# EasyEDA Pro project ProPrj_2025f4拓展板025-07-20.epro

# Schematic Schematic1
Board Name: Board1; Create Date: 2025-07-18; Page Name: P1; Project Name: 2025电赛拓展板7月; Schematic Name: Schematic1; Update Date: 2025-07-18; Company: 嘉立创EDA; Page Size: A4; Version: V1.0
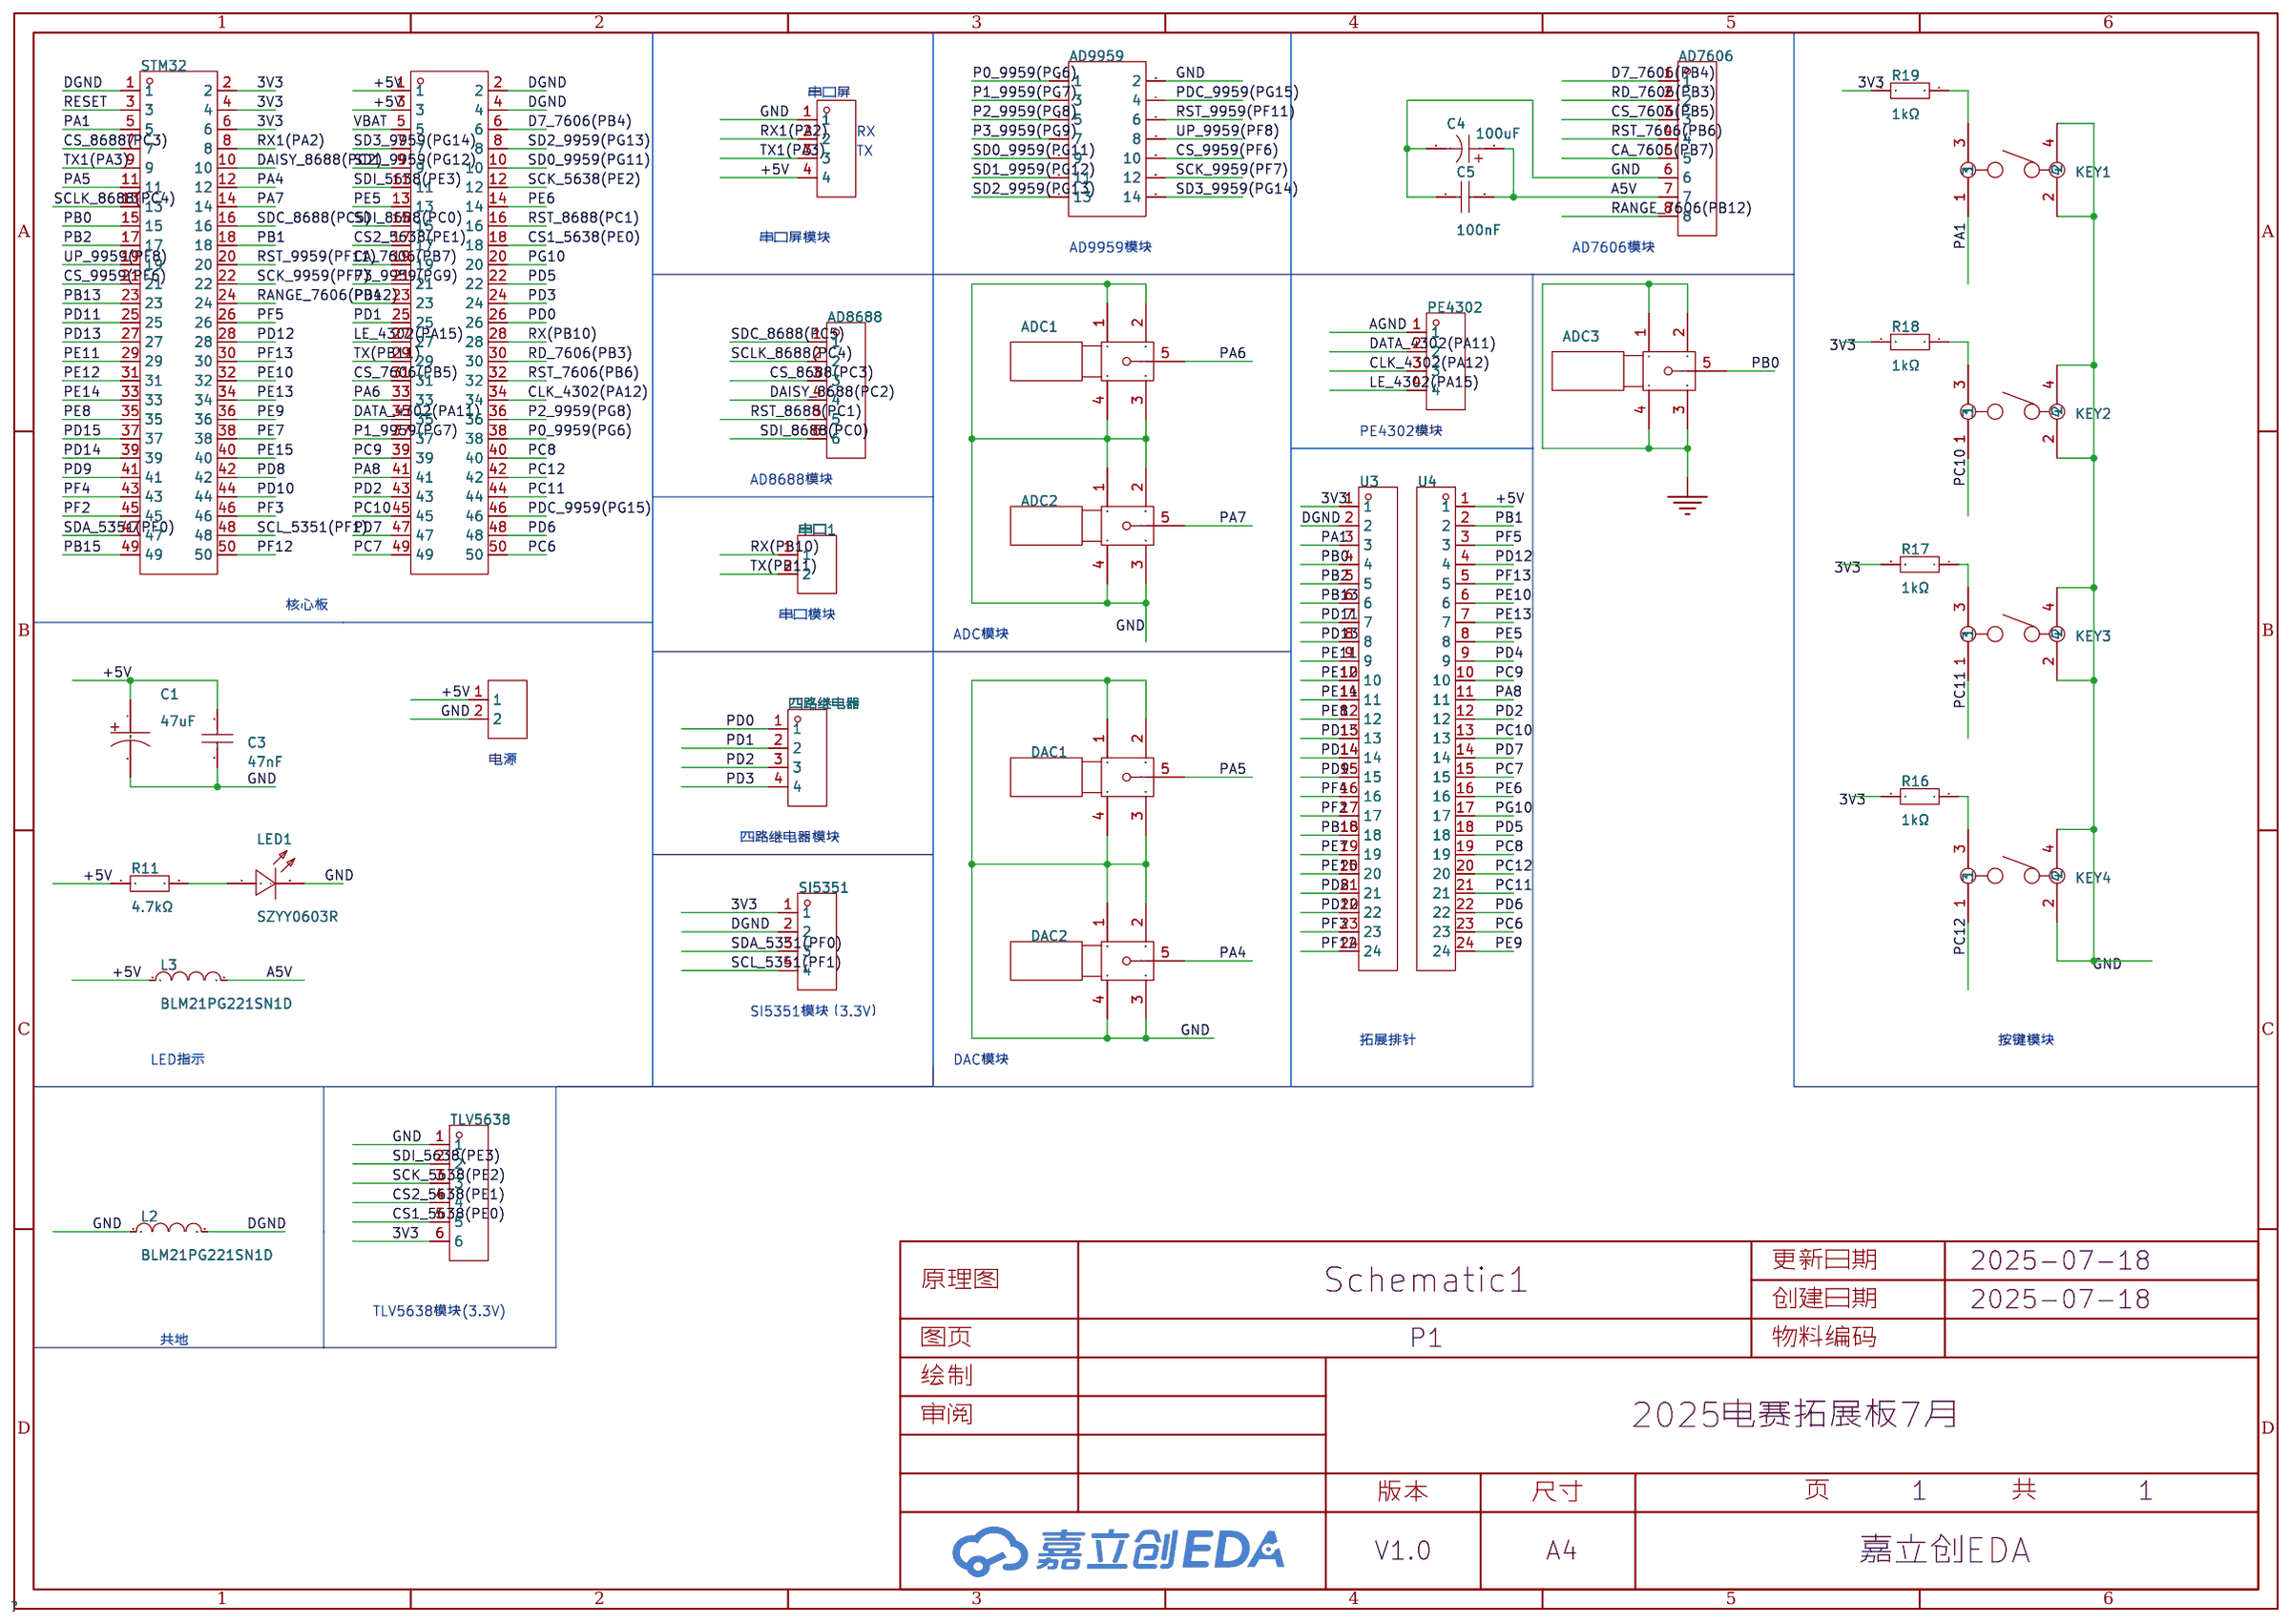
[diagram p0: schematic sheet]

## Parts
AD7606  ZX-XH2.54-8PZZ  [CONN-TH_8P-P2.50-XH2.54-8P]
AD8688  ZX-XH2.54-6PZZ  [CONN-TH_6P-P2.50_ZX-XH2.54-6PZZ]
AD9959  2.54-2*7P简牛  [IDC-TH_14P-P2.54-V-R2-C7-S2.54]
ADC1  BWSMA-KE-P001  [SMA-SMD_BWSMA-KE-P001]
ADC2  BWSMA-KE-P001  [SMA-SMD_BWSMA-KE-P001]
ADC3  BWSMA-KE-P001  [SMA-SMD_BWSMA-KE-P001]
C1  47uF  [CAP-TH_BD5.0-P2.00-D0.8-FD]
C3  47nF  [C0805]
C4  100uF  [CAP-TH_BD8.0-P3.50-D0.5-FD]
C5  100nF  [C0805]
DAC1  BWSMA-KE-P001  [SMA-SMD_BWSMA-KE-P001]
DAC2  BWSMA-KE-P001  [SMA-SMD_BWSMA-KE-P001]
KEY1  -  [4角直插式开关]
KEY2  -  [4角直插式开关]
KEY3  -  [4角直插式开关]
KEY4  -  [4角直插式开关]
L2  BLM21PG221SN1D  [L0805]
L3  BLM21PG221SN1D  [L0805]
LED1  SZYY0603R  [LED0603-R-RD]
OLED显示屏模块2  ZX-XH2.54-4PZZ  [CONN-TH_4P-P2.50_4PIN]
PE4302  ZX-XH2.54-4PZZ  [CONN-TH_4P-P2.50_4PIN]
R11  4.7kΩ  [R0805]
R16  1kΩ  [R0805]
R17  1kΩ  [R0805]
R18  1kΩ  [R0805]
R19  1kΩ  [R0805]
SI5351  ZX-XH2.54-4PZZ  [CONN-TH_4P-P2.50_4PIN]
STM32  ZX-PM2.54-2-25PY  [HDR-TH_50P-P2.54-V-F-R2-C25-S2.54-1]
TLV5638  ZX-XH2.54-6PZZ  [CONN-TH_6P-P2.50_ZX-XH2.54-6PZZ]
U2  ZX-PM2.54-2-25PY  [HDR-TH_50P-P2.54-V-F-R2-C25-S2.54-1]
U3  HC-PM254-8.5H-1x24PZ  [HDR-TH_24P-P2.54-V-F]
U4  HC-PM254-8.5H-1x24PZ  [HDR-TH_24P-P2.54-V-F]
串口  ZX-XH2.54-2PZZ  [CONN-TH_2P-P2.50_HX25003-2A]
串口1  ZX-XH2.54-2PZZ  [CONN-TH_2P-P2.50_HX25003-2A]
四路继电器  ZX-XH2.54-4PZZ  [CONN-TH_4P-P2.50_4PIN]

## Library data of the parts
AD7606 = ZX-XH2.54-8PZZ: 插针结构:1x8P;间距:2.5mm;安装方式:直插;参考系列:XH;总PIN数:8P;排数:1;每排PIN数:8;行距:-;额定电流:3A;触头材质:黄铜;触头镀层:锡;工作温度:-25℃~+85℃;; LCSC Part Name: 1x8P 间距:2.5mm 直插 系列:XH; Supplier Part: C7429638; Manufacturer: Megastar(兆星); Supplier Footprint: 插件,P=2.5mm; JLCPCB Part Class: 扩展库; Datasheet: https://atta.szlcsc.com/upload/public/pdf/source/20230619/688603DEA58996C00B1F33C46797D2C3.pdf; Supplier: LCSC; Pins Structure: 1x8P; Pitch: 2.5mm; Mounting Type: 直插; Reference Series: XH; Number of Pins: 8P; Number of Rows: 1; Number of PINs Per Row: 8; Current Rating: 3A; Contact Material: 黄铜; Contact Plating: 锡; Operating Temperature: -25℃~+85℃; Voltage Rating: 250V; Plastic Material: PA66; Flame Retardant Rating: UL94V-0; Color: 白色; Z-Height of the Board: 7mm; X-Length of Bottom Edge on Board (Spacing Line): 22.5mm; Y-Width of Bottom Edge on Board: 5.9mm
AD8688 TLV5638 = ZX-XH2.54-6PZZ: 插针结构:1x6P;间距:2.5mm;安装方式:直插;参考系列:XH;总PIN数:6P;排数:1;每排PIN数:6;行距:-;额定电流:3A;触头材质:黄铜;触头镀层:锡;工作温度:-25℃~+85℃;; LCSC Part Name: 1x6P 间距:2.5mm 直插 系列:XH; Supplier Part: C7429636; Manufacturer: Megastar(兆星); Supplier Footprint: 插件,P=2.5mm; JLCPCB Part Class: 扩展库; Datasheet: https://atta.szlcsc.com/upload/public/pdf/source/20230619/1243AD0A516E39CD3D274D8985780568.pdf; Supplier: LCSC; Pins Structure: 1x6P; Pitch: 2.5mm; Mounting Type: 直插; Reference Series: XH; Number of Pins: 6P; Number of Rows: 1; Number of PINs Per Row: 6; Current Rating: 3A; Contact Material: 黄铜; Contact Plating: 锡; Operating Temperature: -25℃~+85℃; Voltage Rating: 250V; Plastic Material: PA66; Flame Retardant Rating: UL94V-0; Color: 白色; Z-Height of the Board: 7mm; X-Length of Bottom Edge on Board (Spacing Line): 17.5mm; Y-Width of Bottom Edge on Board: 5.9mm
AD9959 = 2.54-2*7P简牛: 连接器类型:简牛座;间距:2.54mm;结构:2x7P;封装形式:直插;行距:2.54mm;排数:2;每排PIN数:7;触头材质:黄铜;触头镀层:金;; LCSC Part Name: 2.54mm 2x7P 排数:2 每排P数:7; Supplier Part: C11215; Manufacturer: BOOMELE(博穆精密); Supplier Footprint: 插件,P=2.54mm; Datasheet: https://atta.szlcsc.com/upload/public/pdf/source/20131122/1457706661483.pdf; Supplier: LCSC; Connector Type: 简牛座; Pitch: 2.54mm; Structure: 2x7P; Holder Type: 直插; Row Spacing: 2.54mm; Number of Rows: 2; Pin Number in each Row: 7; Contact Material: 黄铜; Contact Plating: 金
ADC1-ADC3 DAC1 DAC2 = BWSMA-KE-P001: 连接器类型:板端;接口类型:内孔;端口数量:1;接口直径:5.2mm;接口长度/高度:-;频率-最大值:-;射频系列:SMA;阻抗:50Ω;样式:偏脚;工作温度范围:-;; LCSC Part Name: 内孔 SMA 偏脚; Supplier Part: C496550; Manufacturer: BAT WIRELESS(蝙蝠无线); Supplier Footprint: SMD; Datasheet: https://atta.szlcsc.com/upload/public/pdf/source/20240320/28FD502871C976DFF213ABFCF2A0ED51.pdf; Supplier: LCSC; Connector Type: 板端; Interface Type: 内孔; Number of Ports: 1; Interface Diameter: 5.2mm; RF Series: SMA; Impedance: 50Ω; Style: 偏脚
C1 = NXB25V47M5*11 2.5TP: 容值:47uF;精度:±20%;额定电压:25V;纹波电流:250mA@100kHz;等效串联电阻(ESR):300mΩ@100kHz;; LCSC Part Name: 47uF ±20% 25V; Supplier Part: C371230; Manufacturer: SAMYOUNG(韩国三莹); Supplier Footprint: 插件,D5xL11mm; JLCPCB Part Class: 扩展库; Datasheet: https://atta.szlcsc.com/upload/public/pdf/source/20190227/C371244_FA85FFEFC2961227CF12E3CCE8C34A7D.pdf; Supplier: LCSC; Tolerance: ±20%; Voltage Rating: 25V; Ripple Current: 250mA@100kHz; Equivalent Series Resistance(ESR): 300mΩ@100kHz; Pin Spacing: 2mm; Diameter: 5mm; Height - Seated (Max): 11mm; Lifetime: 2000hrs@105℃; Operating Temperature: -40℃~+105℃
C3 = CL21B473KBCNNNC: 容值:47nF;精度:±10%;额定电压:50V;材质(温度系数):X7R;; LCSC Part Name: 47nF ±10% 50V; Supplier Part: C53134; Manufacturer: SAMSUNG(三星); Supplier Footprint: 0805; JLCPCB Part Class: 基础库; Datasheet: https://atta.szlcsc.com/upload/public/pdf/source/20160218/1457707763339.pdf; Supplier: LCSC; Tolerance: ±10%; Voltage Rated: 50V; Temperature Coefficient: X7R
C4 = ERG50V100M8X12: 容值:100uF;精度:±20%;额定电压:50V;纹波电流:680mA@120Hz;等效串联电阻(ESR):120mΩ;; LCSC Part Name: 100uF ±20% 50V; Supplier Part: C47344183; Manufacturer: 捷而瑞; Supplier Footprint: 插件,D8xL12mm; JLCPCB Part Class: 扩展库; Datasheet: https://atta.szlcsc.com/upload/public/pdf/source/20250526/717B4C76834FE5C4A331D19A222D031C.pdf; Supplier: LCSC; Tolerance: ±20%; Voltage Rating: 50V; Ripple Current: 680mA@120Hz; Equivalent Series Resistance(ESR): 120mΩ; Diameter: 8mm; Height - Seated (Max): 12mm; Lifetime: 4000hrs@105℃; Operating Temperature: -40℃~+105℃
C5 = CL21B104KBCNNNC: 容值:100nF;精度:±10%;额定电压:50V;材质(温度系数):X7R;; LCSC Part Name: 100nF ±10% 50V; Supplier Part: C1711; Manufacturer: SAMSUNG(三星); Supplier Footprint: 0805; JLCPCB Part Class: 扩展库; Datasheet: https://atta.szlcsc.com/upload/public/pdf/source/20160218/1457707763339.pdf; Supplier: LCSC; Tolerance: ±10%; Voltage Rated: 50V; Temperature Coefficient: X7R
KEY1-KEY4 = 4角直插式开关: 4.5*4.5*3.8
L2 L3 = BLM21PG221SN1D: 标称阻抗@测试频率:220Ω@100MHz;误差:±25%;直流电阻(RDC):45mΩ;; LCSC Part Name: 单路 0805磁珠 阻抗220Ω@100MHz; Supplier Part: C85840; Manufacturer: muRata(村田); Supplier Footprint: 0805; JLCPCB Part Class: 扩展库; Datasheet: https://atta.szlcsc.com/upload/public/pdf/source/20180326/C118443_3FAC30E9A4F0E6B81275543C61E0685E.pdf; Supplier: LCSC; Impedance @ Frequency: 220Ω@100MHz; Tolerance: ±25%; DC Resistance: 45mΩ; Current Rating: 2A; Circuits: 1
LED1 = SZYY0603R: 发光颜色:红色;功率:40mW;正向电流:20mA;主波长:615nm~630nm;二极管配置:-;透镜颜色:无色透明透镜;色温:-;发光角度:120°;载带方式:-;工作温度:-40℃~+85℃;; LCSC Part Name: 红灯; Supplier Part: C434419; Manufacturer: yongyu(永裕光电); Supplier Footprint: 0603; JLCPCB Part Class: 扩展库; Datasheet: https://atta.szlcsc.com/upload/public/pdf/source/20191204/C434419_0B955C1F73FF88449D9A795B6FF49070.pdf; Supplier: LCSC; Emitted Color: 红色; Power Dissipation: 40mW; Forward Current: 20mA; Dominant Wavelength: 615nm~630nm; Peak Wavelength: 645nm; Lens Color: 无色透明透镜; Viewing Angle: 120°; Operating Temperature: -40℃~+85℃
OLED显示屏模块2 PE4302 SI5351 四路继电器 = ZX-XH2.54-4PZZ: 插针结构:1x4P;间距:2.5mm;安装方式:直插;参考系列:XH;总PIN数:4P;排数:1;每排PIN数:4;行距:-;额定电流:3A;触头材质:黄铜;触头镀层:锡;工作温度:-25℃~+85℃;; LCSC Part Name: 1x4P 间距:2.5mm 直插 系列:XH; Supplier Part: C7429634; Manufacturer: Megastar(兆星); Supplier Footprint: 插件,P=2.5mm; JLCPCB Part Class: 扩展库; Datasheet: https://atta.szlcsc.com/upload/public/pdf/source/20230619/B529A2163E0159A644AB3383D208FB03.pdf; Supplier: LCSC; Pins Structure: 1x4P; Pitch: 2.5mm; Mounting Type: 直插; Reference Series: XH; Number of Pins: 4P; Number of Rows: 1; Number of PINs Per Row: 4; Current Rating: 3A; Contact Material: 黄铜; Contact Plating: 锡; Operating Temperature: -25℃~+85℃; Voltage Rating: 250V; Plastic Material: PA66; Flame Retardant Rating: UL94V-0; Color: 白色; Z-Height of the Board: 7mm; X-Length of Bottom Edge on Board (Spacing Line): 12.5mm; Y-Width of Bottom Edge on Board: 5.9mm
R11 = 0805W8F4701T5E: 电阻类型:厚膜电阻;阻值:4.7kΩ;精度:±1%;功率:125mW;最大工作电压:150V;温度系数:±100ppm/℃;; LCSC Part Name: 4.7kΩ ±1% 125mW 厚膜电阻; Supplier Part: C17673; Manufacturer: UNI-ROYAL(厚声); Supplier Footprint: 0805; JLCPCB Part Class: 基础库; Datasheet: https://atta.szlcsc.com/upload/public/pdf/source/20200306/C422600_1E6D84923E4A46A82E41ADD87F860B5C.pdf; Supplier: LCSC; Type: 厚膜电阻; Tolerance: ±1%; Power(Watts): 125mW; Overload Voltage (Max): 150V; Temperature Coefficient: ±100ppm/℃; Operating Temperature Range: -55℃~+155℃
R16-R19 = 0805W8F1001T5E: 电阻类型:厚膜电阻;阻值:1kΩ;精度:±1%;功率:125mW;温度系数:±100ppm/℃;最大工作电压:150V;工作温度范围:-55℃~+155℃;; LCSC Part Name: 1kΩ ±1% 125mW; Supplier Part: C17513; Manufacturer: UNI-ROYAL(厚声); Supplier Footprint: 0805; JLCPCB Part Class: Basic Part; Datasheet: https://atta.szlcsc.com/upload/public/pdf/source/20200306/C422600_1E6D84923E4A46A82E41ADD87F860B5C.pdf; Supplier: LCSC; Type: 厚膜电阻; Tolerance: ±1%; Power(Watts): 125mW; Temperature Coefficient: ±100ppm/℃; Overload Voltage (Max): 150V; Operating Temperature Range: -55℃~+155℃
STM32 U2 = ZX-PM2.54-2-25PY: 插孔结构:2x25P;间距:2.54mm;行距:2.54mm;圆孔/方孔:方孔;安装类型:直插;排数:双排;总孔位数:50P;额定电流:-;额定电压:1kV;插孔方向:顶部;塑高:8.5mm;触头材质:-;触头镀层:金;工作温度范围:-40℃~+105℃;焊接温度(最大值):260℃@5S;; LCSC Part Name: 2x25P 间距:2.54mm 直插; Supplier Part: C7499355; Manufacturer: Megastar(兆星); Supplier Footprint: 插件,P=2.54mm; JLCPCB Part Class: 扩展库; Datasheet: https://atta.szlcsc.com/upload/public/pdf/source/20231122/49E5BFC403566950E1C41AC60FCE7E93.pdf; Supplier: LCSC; Holes Structure: 2x25P; Pitch: 2.54mm; Row Spacing: 2.54mm; Circular Hole / Square Hole: 方孔; Mounting Type: 直插; Number of Rows: 双排; Number of Holes: 50P; Voltage Rating (Max): 1kV; Holes Direction: 顶部; Insulation Height: 8.5mm; Contact Plating: 金; Operating Temperature Range: -40℃~+105℃; Soldering Temperature(Max): 260℃@5S
U3 U4 = HC-PM254-8.5H-1x24PZ: 插孔结构:1x24P;间距:2.54mm;行距:-;圆孔/方孔:方孔;安装方式:直插;排数:单排;总孔位数:24P;额定电流:3A;额定电压:-;插孔方向:顶部;塑高:8.5mm;触头材质:黄铜;触头镀层:金;工作温度:-40℃~+105℃;; LCSC Part Name: 间距2.54mm 1x24Pin 直插 PC3.0 H8.5; Supplier Part: C41376163; Manufacturer: HC(虹成电子); Supplier Footprint: 插件,P=2.54mm; JLCPCB Part Class: 扩展库; Datasheet: https://atta.szlcsc.com/upload/public/pdf/source/20250106/3FBD04873CC9DF7EB7D4CB725B508409.pdf; Supplier: LCSC; Holes Structure: 1x24P; Pitch: 2.54mm; Circular Hole / Square Hole: 方孔; Mounting Type: 直插; Number of Rows: 单排; Number of Positions: 24P; Current Rating: 3A; Holes Direction: 顶部; Insulation Height: 8.5mm; Contact Material: 黄铜; Contact Plating: 金; Operating Temperature: -40℃~+105℃; PIN Length: 3mm
串口 串口1 = ZX-XH2.54-2PZZ: 插针结构:1x2P;间距:2.5mm;安装方式:直插;参考系列:XH;总PIN数:2P;排数:1;每排PIN数:2;行距:-;额定电流:3A;触头材质:黄铜;触头镀层:锡;工作温度:-25℃~+85℃;; LCSC Part Name: 1x2P 间距:2.5mm 直插 系列:XH; Supplier Part: C7429632; Manufacturer: Megastar(兆星); Supplier Footprint: 插件,P=2.5mm; JLCPCB Part Class: 扩展库; Datasheet: https://atta.szlcsc.com/upload/public/pdf/source/20230619/19BA6947230AA44A04D3EDD65E618FD0.pdf; Supplier: LCSC; Pins Structure: 1x2P; Pitch: 2.5mm; Mounting Type: 直插; Reference Series: XH; Number of Pins: 2P; Number of Rows: 1; Number of PINs Per Row: 2; Current Rating: 3A; Contact Material: 黄铜; Contact Plating: 锡; Operating Temperature: -25℃~+85℃; Voltage Rating: 250V; Plastic Material: PA66; Flame Retardant Rating: UL94V-0; Color: 白色; Z-Height of the Board: 7mm; X-Length of Bottom Edge on Board (Spacing Line): 7.5mm; Y-Width of Bottom Edge on Board: 5.9mm

## Nets
3V3: R16.2 R17.2 R18.2 R19.2 SI5351.1 STM32.2 STM32.4 STM32.6 TLV5638.6 U3.1
+5V: C1.1 C3.2 L3.1 OLED显示屏模块2.4 R11.1 U2.1 U2.3 U4.1 串口.1
A5V: AD7606.7 C4.1 C5.2 L3.2
AGND: PE4302.1
DGND: L2.2 SI5351.2 STM32.1 U2.2 U2.4 U3.2
GND: AD7606.6 AD9959.2 ADC1.1 ADC1.2 ADC1.3 ADC1.4 ADC2.1 ADC2.2 ADC2.3 ADC2.4 ADC3.1 ADC3.2 ADC3.3 ADC3.4 C1.2 C3.1 C4.2 C5.1 DAC1.1 DAC1.2 DAC1.3 DAC1.4 DAC2.1 DAC2.2 DAC2.3 DAC2.4 KEY1.2 KEY1.4 KEY2.2 KEY2.4 KEY3.2 KEY3.4 KEY4.2 KEY4.4 L2.1 LED1.2(-) OLED显示屏模块2.1 TLV5638.1 串口.2
VBAT: U2.5
CA_7606(PB7): AD7606.5 U2.19
CLK_4302(PA12): PE4302.3 U2.34
CS1_5638(PE0): TLV5638.5 U2.18
CS2_5638(PE1): TLV5638.4 U2.17
CS_7606(PB5): AD7606.3 U2.31
CS_8688(PC3): AD8688.3 STM32.7
CS_9959(PF6): AD9959.10 STM32.21
D7_7606(PB4): AD7606.1 U2.6
DAISY_8688(PC2): AD8688.4 STM32.10
DATA_4302(PA11): PE4302.2 U2.35
LE_4302(PA15): PE4302.4 U2.27
P0_9959(PG6): AD9959.1 U2.38
P1_9959(PG7): AD9959.3 U2.37
P2_9959(PG8): AD9959.5 U2.36
P3_9959(PG9): AD9959.7 U2.21
PA1: KEY1.1 STM32.5 U3.3
PA4: DAC2.5 STM32.12
PA5: DAC1.5 STM32.11
PA6: ADC1.5 U2.33
PA7: ADC2.5 STM32.14
PA8: U2.41 U4.11
PB0: ADC3.5 STM32.15 U3.4
PB1: STM32.18 U4.2
PB2: STM32.17 U3.5
PB13: STM32.23 U3.6
PB15: STM32.49 U3.18
PC6: U2.50 U4.23
PC7: U2.49 U4.15
PC8: U2.40 U4.19
PC9: U2.39 U4.10
PC10: KEY2.1 U2.45 U4.13
PC11: KEY3.1 U2.44 U4.21
PC12: KEY4.1 U2.42 U4.20
PD0: U2.26 四路继电器.1
PD1: U2.25 四路继电器.2
PD2: U2.43 U4.12 四路继电器.3
PD3: U2.24 四路继电器.4
PD4: U2.23 U4.9
PD5: U2.22 U4.18
PD6: U2.48 U4.22
PD7: U2.47 U4.14
PD8: STM32.42 U3.21
PD9: STM32.41 U3.15
PD10: STM32.44 U3.22
PD11: STM32.25 U3.7
PD12: STM32.28 U4.4
PD13: STM32.27 U3.8
PD14: STM32.39 U3.14
PD15: STM32.37 U3.13
PDC_9959(PG15): AD9959.4 U2.46
PE5: U2.13 U4.8
PE6: U2.14 U4.16
PE7: STM32.38 U3.19
PE8: STM32.35 U3.12
PE9: STM32.36 U4.24
PE10: STM32.32 U4.6
PE11: STM32.29 U3.9
PE12: STM32.31 U3.10
PE13: STM32.34 U4.7
PE14: STM32.33 U3.11
PE15: STM32.40 U3.20
PF2: STM32.45 U3.17
PF3: STM32.46 U3.23
PF4: STM32.43 U3.16
PF5: STM32.26 U4.3
PF12: STM32.50 U3.24
PF13: STM32.30 U4.5
PG10: U2.20 U4.17
RANGE_7606(PB12): AD7606.8 STM32.24
RD_7606(PB3): AD7606.2 U2.30
RESET: STM32.3
RST_7606(PB6): AD7606.4 U2.32
RST_8688(PC1): AD8688.5 U2.16
RST_9959(PF11): AD9959.6 STM32.20
RX1(PA2): OLED显示屏模块2.2 STM32.8
RX(PB10): U2.28 串口1.1
SCK_5638(PE2): TLV5638.3 U2.12
SCK_9959(PF7): AD9959.12 STM32.22
SCL_5351(PF1): SI5351.4 STM32.48
SCLK_8688(PC4): AD8688.2 STM32.13
SD0_9959(PG11): AD9959.9 U2.10
SD1_9959(PG12): AD9959.11 U2.9
SD2_9959(PG13): AD9959.13 U2.8
SD3_9959(PG14): AD9959.14 U2.7
SDA_5351(PF0): SI5351.3 STM32.47
SDC_8688(PC5): AD8688.1 STM32.16
SDI_5638(PE3): TLV5638.2 U2.11
SDI_8688(PC0): AD8688.6 U2.15
TX1(PA3): OLED显示屏模块2.3 STM32.9
TX(PB11): U2.29 串口1.2
UP_9959(PF8): AD9959.8 STM32.19
$1N1573: LED1.1(+) R11.2
Net-(KEY1-3): KEY1.3 R19.1
Net-(KEY2-3): KEY2.3 R18.1
Net-(KEY3-3): KEY3.3 R17.1
Net-(KEY4-3): KEY4.3 R16.1

## Notes on the sheet
- 串口屏
- RX
- TX
- 串口屏模块
- AD9959模块
- AD7606模块
- PE4302模块
- AD8688模块
- 核心板
- 串口模块
- ADC模块
- 电源
- 四路继电器模块
- SI5351模块（3.3V）
- 拓展排针
- 按键模块
- LED指示
- DAC模块
- TLV5638模块(3.3V)
- 共地

# Board PCB1
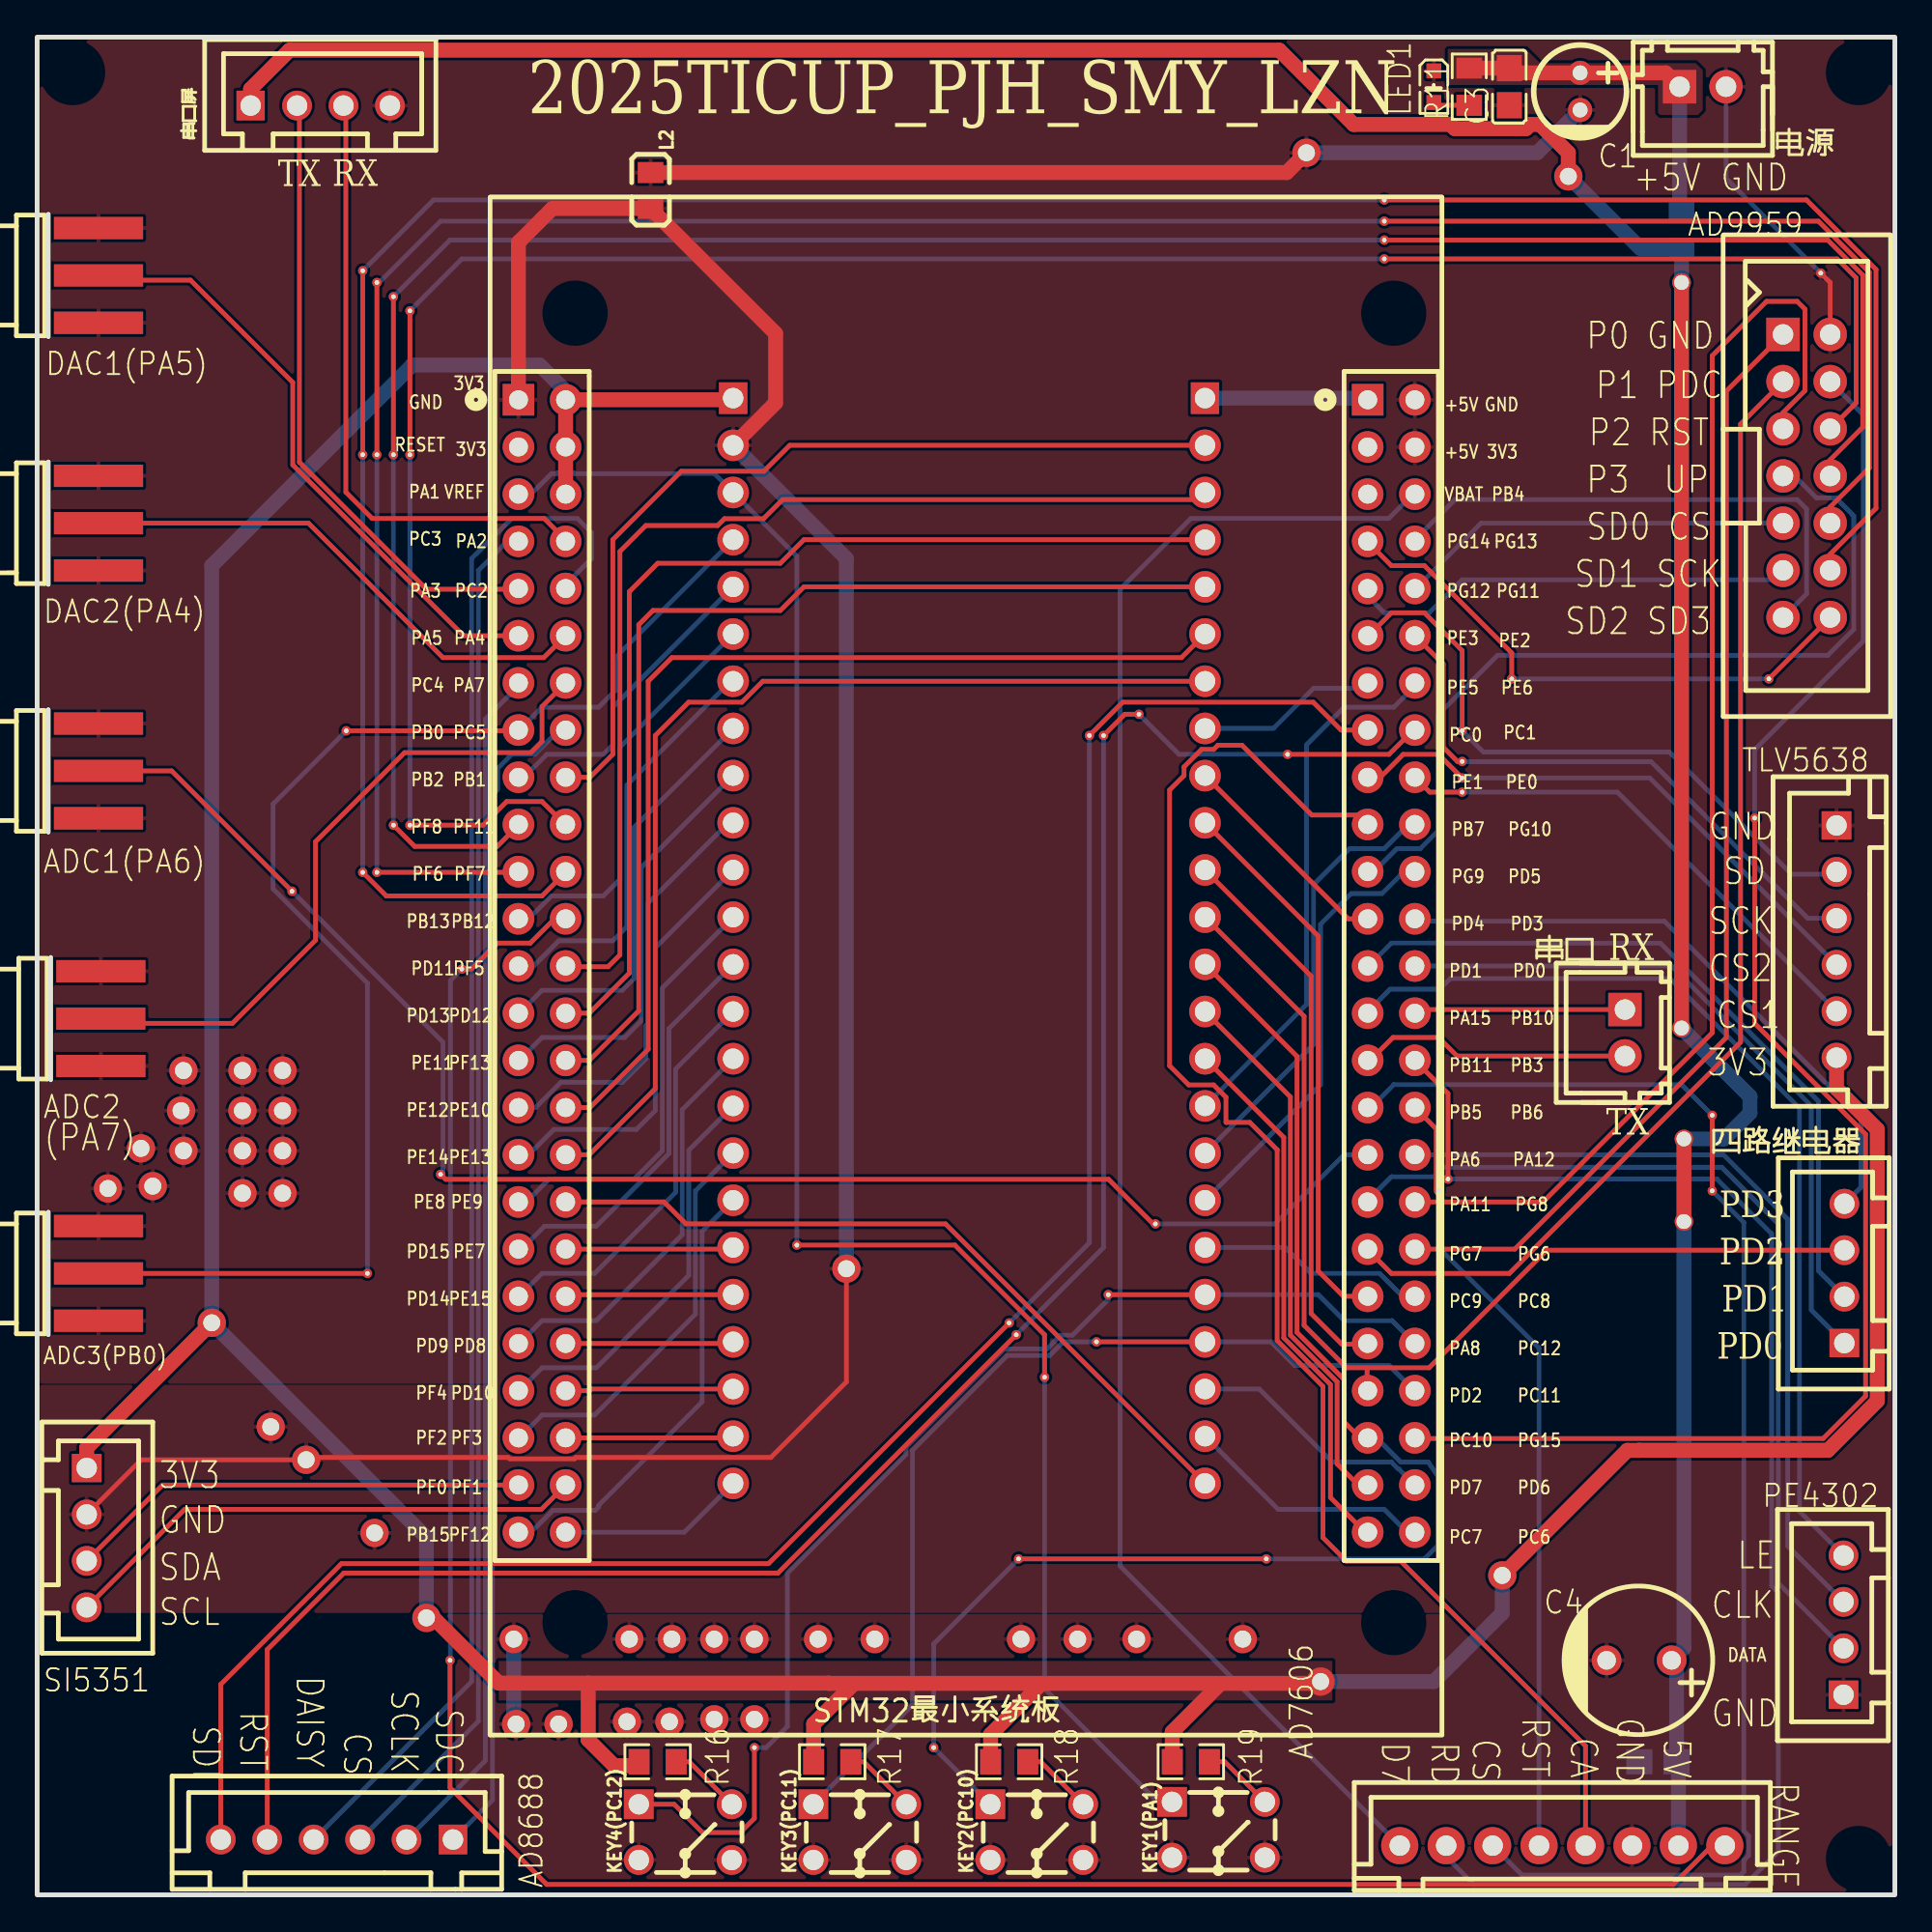
[diagram p1: board, top side]
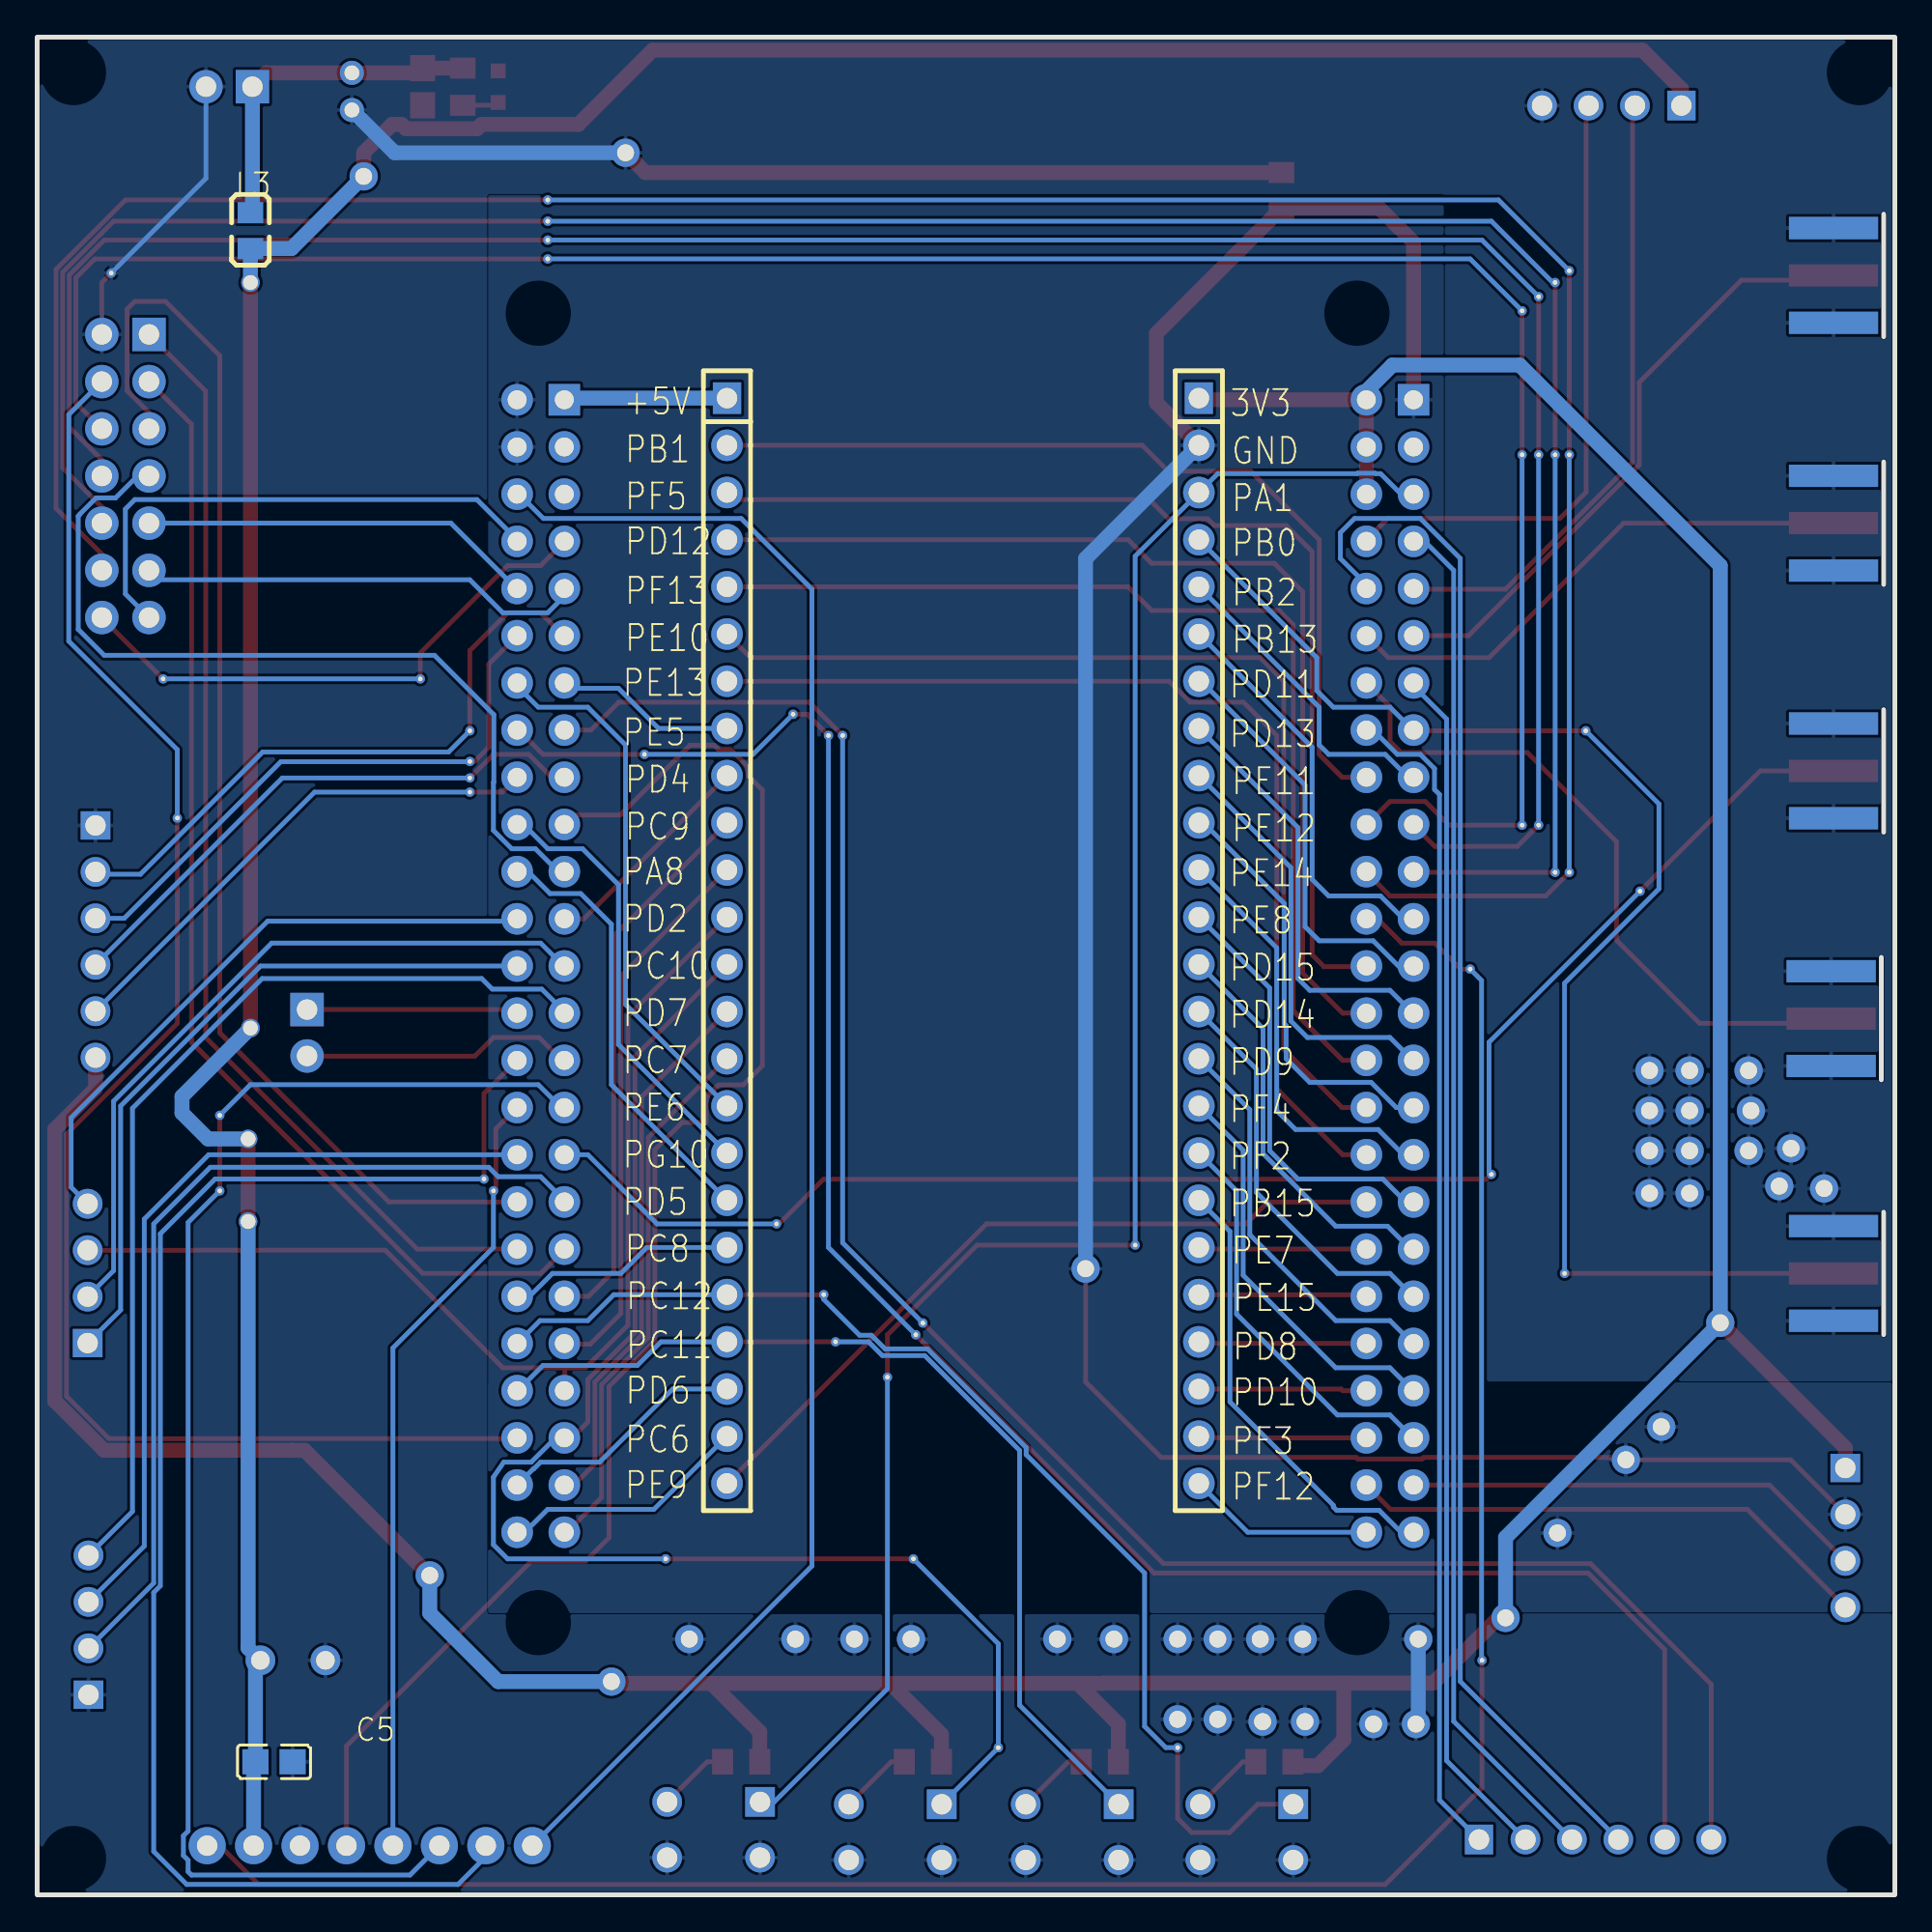
[diagram p2: board, bottom side, seen from below]

Outline 100 x 100 mm; copper layers: Top Layer, Bottom Layer. Coordinates in mm from the lower left corner of the outline.
Outline path: rectangle 0,100 100,0
Stack: Top Layer 0.035mm / Dielectric1 1.51mm FR4 er 4.5 / Bottom Layer 0.035mm

## Design rules (mm)
template: JLCPCB Capability(Two Layers Board)
spacing copperThickness1oz (default): track to track 0.102, other pairs 0.152 to 0.3
spacing copperThickness2oz: track to track 0.203, other pairs 0.152 to 0.3
track width copperThickness1oz (default): min 0.127, default 0.254, max 2.54
track width copperThickness2oz: min 0.203, default 0.254, max 2.54
differential pair differentialPair (default): width min 0.127, default 0.254, max 2.54; gap min 0.152, default 0.152
via viaSize (default): diameter min 0.5, default 0.61, max 10; hole min 0.3, default 0.305, max 6.3

## Placement (name value [footprint] x y rotation side)
AD7606  ZX-XH2.54-8PZZ  [CONN-TH_8P-P2.50-XH2.54-8P]  82.1 2.65 180 top
AD8688  ZX-XH2.54-6PZZ  [CONN-TH_6P-P2.50_ZX-XH2.54-6PZZ]  16.13 2.98 0 top
AD9959  2.54-2*7P简牛  [IDC-TH_14P-P2.54-V-R2-C7-S2.54]  95.25 76.38 270 top
ADC1(PA6)  BWSMA-KE-P001  [SMA-SMD_BWSMA-KE-P001]  3.3 60.5 180 top
ADC2  BWSMA-KE-P001  [SMA-SMD_BWSMA-KE-P001]  3.43 47.17 180 top
ADC3(PB0)  BWSMA-KE-P001  [SMA-SMD_BWSMA-KE-P001]  3.3 33.45 180 top
C1  47uF  [CAP-TH_BD5.0-P2.00-D0.8-FD]  83.06 97.08 270 top
C3  47nF  [C0805]  79.25 97.33 90 top
C4  100uF  [CAP-TH_BD8.0-P3.50-D0.5-FD]  86.23 12.62 180 top
C5  100nF  [C0805]  87.25 7.16 0 bottom
DAC1(PA5)  BWSMA-KE-P001  [SMA-SMD_BWSMA-KE-P001]  3.3 87.17 180 top
DAC2(PA4)  BWSMA-KE-P001  [SMA-SMD_BWSMA-KE-P001]  3.3 73.84 180 top
KEY1(PA1)  -  [4角直插式开关]  61.09 5 0 top
KEY2(PC10)  -  [4角直插式开关]  51.31 4.88 0 top
KEY3(PC11)  -  [4角直插式开关]  41.78 4.88 0 top
KEY4(PC12)  -  [4角直插式开关]  32.38 4.88 0 top
L2  BLM21PG221SN1D  [L0805]  33.02 91.75 270 top
L3  BLM21PG221SN1D  [L0805]  88.52 89.59 270 bottom
LED1  SZYY0603R  [LED0603-R-RD]  75.18 97.33 270 top
NOREF  -  [Pad_e1397]  88.52 86.79 0 top
NOREF#2  -  [Pad_e2048]  13.21 42.22 0 top
NOREF#3  -  [Pad_e2021]  36.45 9.45 0 top
NOREF#4  -  [Pad_e1139]  93.22 65.46 0 top
NOREF#5  -  [Pad_e2028]  52.96 13.77 0 top
NOREF#6  -  [Pad_e2050]  13.21 37.77 0 top
NOREF#7  -  [Pad_e732]  76.71 61.01 0 top
NOREF#8  -  [Pad_e2063]  69.09 11.48 0 top
NOREF#9  -  [Pad_e965]  56.64 62.41 0 top
NOREF#10  -  [Pad_e150]  66.17 18.09 0 top
NOREF#11  -  [Pad_e2019]  34.16 13.77 0 top
NOREF#12  -  [Pad_e902]  90.17 37.9 0 top
NOREF#13  -  [Pad_e3359]  96.01 87.3 0 top
NOREF#14  -  [Pad_e2039]  3.81 38.02 0 top
NOREF#15  -  [Pad_e1266]  19.18 86.03 0 top
NOREF#16  -  [Pad_e983]  59.31 63.55 0 top
NOREF#17  -  [Pad_e1928]  43.56 33.71 0 top
NOREF#18  -  [Pad_e1285]  17.53 55.04 0 top
NOREF#19  -  [Pad_e2114]  16.64 62.66 0 top
NOREF#20  -  [Pad_e2036]  14.48 23.42 0 top
NOREF#21  -  [Pad_e96]  38.61 7.93 0 top
NOREF#22  -  [Pad_e2020]  36.45 13.77 0 top
NOREF#23  -  [Pad_e2040]  5.59 40.18 0 top
NOREF#24  -  [Pad_e148]  52.83 18.09 0 top
NOREF#25  -  [Pad_e2047]  13.21 44.37 0 top
NOREF#26  -  [Pad_e1288]  20.07 57.58 0 top
NOREF#27  -  [Pad_e141]  57.02 29.77 0 top
NOREF#28  -  [Pad_e1860]  28.07 9.19 0 top
NOREF#29  -  [Pad_e2038]  6.22 38.15 0 top
NOREF#30  -  [Pad_e2109]  17.78 33.45 0 top
NOREF#31  -  [Pad_e1407]  88.65 36.25 0 top
NOREF#32  -  [Pad_e1026]  22.22 12.62 0 top
NOREF#33  -  [Pad_e890]  75.95 38.53 0 top
NOREF#34  -  [Pad_e1400]  88.52 46.66 0 top
NOREF#35  -  [Pad_e2022]  38.61 9.45 0 top
NOREF#36  -  [Pad_e2018]  34.04 9.32 0 top
NOREF#37  -  [Pad_e1280]  20.07 77.52 0 top
NOREF#38  -  [Pad_e1287]  19.18 57.58 0 top
NOREF#39  -  [Pad_e725]  76.71 60.12 0 top
NOREF#40  -  [Pad_e2045]  11.05 40.06 0 top
NOREF#41  -  [Pad_e1919]  54.23 27.86 0 top
NOREF#42  -  [Pad_e2025]  42.04 13.77 0 top
NOREF#43  -  [Pad_e1028]  22.86 49.83 0 top
NOREF#44  -  [Pad_e1171]  92.46 57.96 0 top
NOREF#45  -  [Pad_e2023]  38.61 13.77 0 top
NOREF#46  -  [Pad_e728]  76.71 62.66 0 top
NOREF#47  -  [Pad_e2067]  78.87 17.2 0 top
NOREF#48  -  [Pad_e1232]  72.52 90.09 0 top
NOREF#49  -  [Pad_e1141]  79.38 65.46 0 top
NOREF#50  -  [Pad_e1233]  72.52 89.08 0 top
NOREF#51  -  [Pad_e2041]  7.75 42.22 0 top
NOREF#52  -  [Pad_e3627]  9.4 30.79 0 top
NOREF#53  -  [Pad_e2015]  31.75 9.32 0 top
NOREF#54  -  [Pad_e1859]  64.9 13.77 0 top
NOREF#55  -  [Pad_e1355]  75.44 37.9 0 top
NOREF#56  -  [Pad_e1934]  68.33 93.78 0 top
NOREF#57  -  [Pad_e1286]  18.29 55.04 0 top
NOREF#58  -  [Pad_e1234]  72.52 88.06 0 top
NOREF#59  -  [Pad_e1279]  19.18 77.52 0 top
NOREF#60  -  [Pad_e1265]  18.29 86.79 0 top
NOREF#61  -  [Pad_e2016]  25.65 13.77 0 top
NOREF#62  -  [Pad_e2033]  12.57 25.2 0 top
NOREF#63  -  [Pad_e2026]  45.09 13.77 0 top
NOREF#64  -  [Pad_e1345]  13.72 54.03 0 top
NOREF#65  -  [Pad_e960]  52.71 30.15 0 top
NOREF#66  -  [Pad_e1881]  57.66 32.31 0 top
NOREF#67  -  [Pad_e1861]  25.78 9.19 0 top
NOREF#68  -  [Pad_e2042]  7.87 44.37 0 top
NOREF#69  -  [Pad_e1405]  88.65 40.69 0 top
NOREF#70  -  [Pad_e2037]  7.87 40.06 0 top
NOREF#71  -  [Pad_e1277]  17.53 77.52 0 top
NOREF#72  -  [Pad_e2046]  11.05 37.77 0 top
NOREF#73  -  [Pad_e1354]  60.2 36.12 0 top
NOREF#74  -  [Pad_e1940]  40.89 34.98 0 top
NOREF#75  -  [Pad_e1278]  18.29 77.52 0 top
NOREF#76  -  [Pad_e2030]  18.16 19.48 0 top
NOREF#77  -  [Pad_e959]  52.32 30.78 0 top
NOREF#78  -  [Pad_e54]  20.95 14.91 0 top
NOREF#79  -  [Pad_e2029]  56.01 13.77 0 top
NOREF#80  -  [Pad_e1264]  17.53 87.43 0 top
NOREF#81  -  [Pad_e145]  48.26 7.93 0 top
NOREF#82  -  [Pad_e2017]  31.88 13.77 0 top
NOREF#83  -  [Pad_e2094]  82.42 92.51 0 top
NOREF#84  -  [Pad_e2049]  13.21 40.06 0 top
NOREF#85  -  [Pad_e2044]  11.05 42.22 0 top
NOREF#86  -  [Pad_e1267]  20.07 85.27 0 top
NOREF#87  -  [Pad_e727]  76.71 59.36 0 top
NOREF#88  -  [Pad_e904]  90.17 41.96 0 top
NOREF#89  -  [Pad_e1348]  21.72 38.79 0 top
NOREF#90  -  [Pad_e966]  57.4 62.41 0 top
NOREF#91  -  [Pad_e2043]  11.05 44.37 0 top
NOREF#92  -  [Pad_e1858]  59.18 13.77 0 top
NOREF#93  -  [Pad_e988]  67.31 61.39 0 top
NOREF#94  -  [Pad_e1231]  72.52 91.24 0 top
PE4302  ZX-XH2.54-4PZZ  [CONN-TH_4P-P2.50_4PIN]  97.24 14.52 90 top
R11  4.7kΩ  [R0805]  77.09 97.33 270 top
R16  1kΩ  [R0805]  33.4 7.16 180 top
R17  1kΩ  [R0805]  42.8 7.16 180 top
R18  1kΩ  [R0805]  52.32 7.16 180 top
R19  1kΩ  [R0805]  62.1 7.16 180 top
SI5351  ZX-XH2.54-4PZZ  [CONN-TH_4P-P2.50_4PIN]  2.67 19.23 270 top
STM32最小系统板  ZX-PM2.54-2-25PY  [HDR-TH_50P-P2.54-V-F-R2-C25-S2.54-1]  27.18 50 270 top
TLV5638  ZX-XH2.54-6PZZ  [CONN-TH_6P-P2.50_ZX-XH2.54-6PZZ]  96.86 51.32 90 top
U2  ZX-PM2.54-2-25PY  [HDR-TH_50P-P2.54-V-F-R2-C25-S2.54-1]  72.89 50 270 top
U3  HC-PM254-8.5H-1x24PZ  [HDR-TH_24P-P2.54-V-F]  37.47 51.36 270 bottom
U4  HC-PM254-8.5H-1x24PZ  [HDR-TH_24P-P2.54-V-F]  62.87 51.36 270 bottom
串口  ZX-XH2.54-2PZZ  [CONN-TH_2P-P2.50_HX25003-2A]  85.47 46.41 270 top
串口屏  ZX-XH2.54-4PZZ  [CONN-TH_4P-P2.50_4PIN]  15.24 96.32 0 top
四路继电器  ZX-XH2.54-4PZZ  [CONN-TH_4P-P2.50_4PIN]  97.28 33.45 90 top
电源  ZX-XH2.54-2PZZ  [CONN-TH_2P-P2.50_HX25003-2A]  89.66 97.33 0 top

## Footprints (pads in the part's own frame, mm; a bottom-side part is the same pattern mirrored in y, then rotated)
4角直插式开关
  rect 1.6x1.6 hole 1.1: 1(0,0)
  round 1.6 hole 1.1: 2(5,0) 3(0,-3) 4(5,-3)
C0805
  rect 1.41x1.35 smd: 1(-1,0) 2(1,0)
CAP-TH_BD5.0-P2.00-D0.8-FD
  round 1.3 hole 0.8: 1(-1,0) 2(1,0)
CAP-TH_BD8.0-P3.50-D0.5-FD
  round 1.6 hole 1: 1(-1.75,0) 2(1.75,0)
CONN-TH_2P-P2.50_HX25003-2A
  rect 1.8x1.8 hole 1.1: 1(-1.25,0)
  round 1.8 hole 1.1: 2(1.25,0)
CONN-TH_4P-P2.50_4PIN
  rect 1.524x1.6 hole 1.1: 1(-3.75,0)
  round 1.6 hole 1.1: 2(-1.25,0) 3(1.25,0) 4(3.75,0)
CONN-TH_6P-P2.50_ZX-XH2.54-6PZZ
  rect 1.524x1.6 hole 1.1: 1(6.25,0)
  round 1.6 hole 1.1: 2(3.75,0) 3(1.25,0) 4(-1.25,0) 5(-3.75,0) 6(-6.25,0)
CONN-TH_8P-P2.50-XH2.54-8P
  round 2 hole 1.1: 1(8.75,0) 2(6.25,0) 3(3.75,0) 4(1.25,0) 5(-1.25,0) 6(-3.75,0) 7(-6.25,0) 8(-8.75,0)
HDR-TH_24P-P2.54-V-F
  rect 1.7x1.524 hole 1.1: 1(-29.21,0)
  round 1.7 hole 1.1: 2(-26.67,0) 3(-24.13,0) 4(-21.59,0) 5(-19.05,0) 6(-16.51,0) 7(-13.97,0) 8(-11.43,0) 9(-8.89,0) 10(-6.35,0) 11(-3.81,0) 12(-1.27,0) 13(1.27,0) 14(3.81,0) 15(6.35,0) 16(8.89,0) 17(11.43,0) 18(13.97,0) 19(16.51,0) 20(19.05,0) 21(21.59,0) 22(24.13,0) 23(26.67,0) 24(29.21,0)
HDR-TH_50P-P2.54-V-F-R2-C25-S2.54-1
  rect 1.7x1.7 hole 1.02: 1(-30.48,-1.27)
  round 1.7 hole 1.02: 2(-30.48,1.27) 3(-27.94,-1.27) 4(-27.94,1.27) 5(-25.4,-1.27) 6(-25.4,1.27) 7(-22.86,-1.27) 8(-22.86,1.27) 9(-20.32,-1.27) 10(-20.32,1.27) 11(-17.78,-1.27) 12(-17.78,1.27) 13(-15.24,-1.27) 14(-15.24,1.27) 15(-12.7,-1.27) 16(-12.7,1.27) 17(-10.16,-1.27) 18(-10.16,1.27) 19(-7.62,-1.27) 20(-7.62,1.27) 21(-5.08,-1.27) 22(-5.08,1.27) 23(-2.54,-1.27) 24(-2.54,1.27) 25(0,-1.27) 26(0,1.27) 27(2.54,-1.27) 28(2.54,1.27) 29(5.08,-1.27) 30(5.08,1.27) 31(7.62,-1.27) 32(7.62,1.27) 33(10.16,-1.27) 34(10.16,1.27) 35(12.7,-1.27) 36(12.7,1.27) 37(15.24,-1.27) 38(15.24,1.27) 39(17.78,-1.27) 40(17.78,1.27) 41(20.32,-1.27) 42(20.32,1.27) 43(22.86,-1.27) 44(22.86,1.27) 45(25.4,-1.27) 46(25.4,1.27) 47(27.94,-1.27) 48(27.94,1.27) 49(30.48,-1.27) 50(30.48,1.27)
IDC-TH_14P-P2.54-V-R2-C7-S2.54
  rect 1.8x1.8 hole 1.1: 1(-7.62,-1.27)
  round 1.8 hole 1.1: 2(-7.62,1.27) 3(-5.08,-1.27) 4(-5.08,1.27) 5(-2.54,-1.27) 6(-2.54,1.27) 7(0,-1.27) 8(0,1.27) 9(2.54,-1.27) 10(2.54,1.27) 11(5.08,-1.27) 12(5.08,1.27) 13(7.62,-1.27) 14(7.62,1.27)
L0805
  rect 1.133x1.377 smd: 1(-0.966,0) 2(0.966,0)
LED0603-R-RD
  rect 0.8x0.8 smd: 1(0.851,0) 2(-0.851,0)
Pad_e54
  round 1.524 hole 0.914: 1(0,0)
Pad_e96
  round 0.5 hole 0.25: 1(0,0)
Pad_e141
  round 0.5 hole 0.25: 1(0,0)
Pad_e145
  round 0.5 hole 0.25: 1(0,0)
Pad_e148
  round 0.5 hole 0.25: 1(0,0)
Pad_e150
  round 0.5 hole 0.25: 1(0,0)
Pad_e725
  round 0.5 hole 0.25: 1(0,0)
Pad_e727
  round 0.5 hole 0.25: 1(0,0)
Pad_e728
  round 0.5 hole 0.25: 1(0,0)
Pad_e732
  round 0.5 hole 0.25: 1(0,0)
Pad_e890
  round 0.5 hole 0.25: 1(0,0)
Pad_e902
  round 0.5 hole 0.25: 1(0,0)
Pad_e904
  round 0.5 hole 0.25: 1(0,0)
Pad_e959
  round 0.5 hole 0.25: 1(0,0)
Pad_e960
  round 0.5 hole 0.25: 1(0,0)
Pad_e965
  round 0.5 hole 0.25: 1(0,0)
Pad_e966
  round 0.5 hole 0.25: 1(0,0)
Pad_e983
  round 0.5 hole 0.25: 1(0,0)
Pad_e988
  round 0.5 hole 0.25: 1(0,0)
Pad_e1026
  round 0.5 hole 0.25: 1(0,0)
Pad_e1028
  round 0.5 hole 0.25: 1(0,0)
Pad_e1139
  round 0.5 hole 0.25: 1(0,0)
Pad_e1141
  round 0.5 hole 0.25: 1(0,0)
Pad_e1171
  round 0.5 hole 0.25: 1(0,0)
Pad_e1231
  round 0.5 hole 0.25: 1(0,0)
Pad_e1232
  round 0.5 hole 0.25: 1(0,0)
Pad_e1233
  round 0.5 hole 0.25: 1(0,0)
Pad_e1234
  round 0.5 hole 0.25: 1(0,0)
Pad_e1264
  round 0.5 hole 0.25: 1(0,0)
Pad_e1265
  round 0.5 hole 0.25: 1(0,0)
Pad_e1266
  round 0.5 hole 0.25: 1(0,0)
Pad_e1267
  round 0.5 hole 0.25: 1(0,0)
Pad_e1277
  round 0.5 hole 0.25: 1(0,0)
Pad_e1278
  round 0.5 hole 0.25: 1(0,0)
Pad_e1279
  round 0.5 hole 0.25: 1(0,0)
Pad_e1280
  round 0.5 hole 0.25: 1(0,0)
Pad_e1285
  round 0.5 hole 0.25: 1(0,0)
Pad_e1286
  round 0.5 hole 0.25: 1(0,0)
Pad_e1287
  round 0.5 hole 0.25: 1(0,0)
Pad_e1288
  round 0.5 hole 0.25: 1(0,0)
Pad_e1345
  round 0.5 hole 0.25: 1(0,0)
Pad_e1348
  round 0.5 hole 0.25: 1(0,0)
Pad_e1354
  round 0.5 hole 0.25: 1(0,0)
Pad_e1355
  round 0.5 hole 0.25: 1(0,0)
Pad_e1397
  round 1 hole 0.8: 1(0,0)
Pad_e1400
  round 1 hole 0.8: 1(0,0)
Pad_e1405
  round 1 hole 0.8: 1(0,0)
Pad_e1407
  round 1 hole 0.8: 1(0,0)
Pad_e1858
  round 1.524 hole 0.914: 1(0,0)
Pad_e1859
  round 1.524 hole 0.914: 1(0,0)
Pad_e1860
  round 1.524 hole 0.914: 1(0,0)
Pad_e1861
  round 1.524 hole 0.914: 1(0,0)
Pad_e1881
  round 0.5 hole 0.25: 1(0,0)
Pad_e1919
  round 0.5 hole 0.25: 1(0,0)
Pad_e1928
  round 1.524 hole 0.914: 1(0,0)
Pad_e1934
  round 1.524 hole 0.914: 1(0,0)
Pad_e1940
  round 0.5 hole 0.25: 1(0,0)
Pad_e2015
  round 1.524 hole 0.914: 1(0,0)
Pad_e2016
  round 1.524 hole 0.914: 1(0,0)
Pad_e2017
  round 1.524 hole 0.914: 1(0,0)
Pad_e2018
  round 1.524 hole 0.914: 1(0,0)
Pad_e2019
  round 1.524 hole 0.914: 1(0,0)
Pad_e2020
  round 1.524 hole 0.914: 1(0,0)
Pad_e2021
  round 1.524 hole 0.914: 1(0,0)
Pad_e2022
  round 1.524 hole 0.914: 1(0,0)
Pad_e2023
  round 1.524 hole 0.914: 1(0,0)
Pad_e2025
  round 1.524 hole 0.914: 1(0,0)
Pad_e2026
  round 1.524 hole 0.914: 1(0,0)
Pad_e2028
  round 1.524 hole 0.914: 1(0,0)
Pad_e2029
  round 1.524 hole 0.914: 1(0,0)
Pad_e2030
  round 1.524 hole 0.914: 1(0,0)
Pad_e2033
  round 1.524 hole 0.914: 1(0,0)
Pad_e2036
  round 1.524 hole 0.914: 1(0,0)
Pad_e2037
  round 1.524 hole 0.914: 1(0,0)
Pad_e2038
  round 1.524 hole 0.914: 1(0,0)
Pad_e2039
  round 1.524 hole 0.914: 1(0,0)
Pad_e2040
  round 1.524 hole 0.914: 1(0,0)
Pad_e2041
  round 1.524 hole 0.914: 1(0,0)
Pad_e2042
  round 1.524 hole 0.914: 1(0,0)
Pad_e2043
  round 1.524 hole 0.914: 1(0,0)
Pad_e2044
  round 1.524 hole 0.914: 1(0,0)
Pad_e2045
  round 1.524 hole 0.914: 1(0,0)
Pad_e2046
  round 1.524 hole 0.914: 1(0,0)
Pad_e2047
  round 1.524 hole 0.914: 1(0,0)
Pad_e2048
  round 1.524 hole 0.914: 1(0,0)
Pad_e2049
  round 1.524 hole 0.914: 1(0,0)
Pad_e2050
  round 1.524 hole 0.914: 1(0,0)
Pad_e2063
  round 1.524 hole 0.914: 1(0,0)
Pad_e2067
  round 1.524 hole 0.914: 1(0,0)
Pad_e2094
  round 1.524 hole 0.914: 1(0,0)
Pad_e2109
  round 0.5 hole 0.25: 1(0,0)
Pad_e2114
  round 0.5 hole 0.25: 1(0,0)
Pad_e3359
  round 0.5 hole 0.25: 1(0,0)
Pad_e3627
  round 1.524 hole 0.914: 1(0,0)
R0805
  rect 1.133x1.377 smd: 1(-1,0) 2(1,0)
SMA-SMD_BWSMA-KE-P001
  rect 4.8x1.2 smd: 1(0,-2.55) 2(0,2.55) 5(0,0)
  rect 4.8x1.2 smd far side: 3(0,2.55) 4(0,-2.55)

## Nets
3V3: NOREF#8.1 NOREF#47.1 NOREF#52.1 NOREF#78.1 R16.2 R17.2 R18.2 R19.2 SI5351.1 STM32最小系统板.2 STM32最小系统板.4 STM32最小系统板.6 TLV5638.6 U3.1
5V: U2.1 U2.3 U4.1
+5V: C1.1 C3.2 L3.1 R11.1 电源.1
A5V: AD7606.7 C4.1 C5.2 L3.2 NOREF.1 NOREF#31.1 NOREF#34.1 NOREF#69.1 NOREF#83.1 串口屏.1
DGND: L2.2 NOREF#17.1 NOREF#20.1 NOREF#62.1 NOREF#76.1 SI5351.2 STM32最小系统板.1 U2.2 U2.4 U3.2
GND: AD7606.6 AD9959.2 ADC1(PA6).1 ADC1(PA6).2 ADC1(PA6).3 ADC1(PA6).4 ADC2.1 ADC2.2 ADC2.3 ADC2.4 ADC3(PB0).1 ADC3(PB0).2 ADC3(PB0).3 ADC3(PB0).4 C1.2 C3.1 C4.2 C5.1 DAC1(PA5).1 DAC1(PA5).2 DAC1(PA5).3 DAC1(PA5).4 DAC2(PA4).1 DAC2(PA4).2 DAC2(PA4).3 DAC2(PA4).4 KEY1(PA1).3 KEY1(PA1).4 KEY2(PC10).3 KEY2(PC10).4 KEY3(PC11).3 KEY3(PC11).4 KEY4(PC12).3 KEY4(PC12).4 L2.1 LED1.2 NOREF#2.1 NOREF#3.1 NOREF#5.1 NOREF#6.1 NOREF#11.1 NOREF#13.1 NOREF#14.1 NOREF#22.1 NOREF#23.1 NOREF#25.1 NOREF#28.1 NOREF#29.1 NOREF#35.1 NOREF#36.1 NOREF#40.1 NOREF#42.1 NOREF#45.1 NOREF#51.1 NOREF#53.1 NOREF#54.1 NOREF#56.1 NOREF#61.1 NOREF#63.1 NOREF#67.1 NOREF#68.1 NOREF#70.1 NOREF#72.1 NOREF#79.1 NOREF#82.1 NOREF#84.1 NOREF#85.1 NOREF#91.1 NOREF#92.1 PE4302.1 TLV5638.1 串口屏.4 电源.2
VBAT: U2.5
CA_7606(PB7): AD7606.5 U2.19
CLK_4302(PA12): PE4302.3 U2.34
CS1_5638(PE0): NOREF#87.1 TLV5638.5 U2.18
CS2_5638(PE1): NOREF#39.1 TLV5638.4 U2.17
CS_7606(PB5): AD7606.3 NOREF#12.1 NOREF#88.1 U2.31
CS_8688(PC3): AD8688.3 STM32最小系统板.7
CS_9959(PF6): AD9959.10 NOREF#48.1 NOREF#57.1 NOREF#60.1 NOREF#75.1 STM32最小系统板.21
D7_7606(PB4): AD7606.1 U2.6
DAISY_8688(PC2): AD8688.4 STM32最小系统板.10
DATA_4302(PA11): PE4302.2 U2.35
LE_4302(PA15): PE4302.4 U2.27
P0_9959(PG6): AD9959.1 U2.38
P1_9959(PG7): AD9959.3 U2.37
P2_9959(PG8): AD9959.5 U2.36
P3_9959(PG9): AD9959.7 U2.21
PA1: KEY1(PA1).1 NOREF#41.1 NOREF#74.1 STM32最小系统板.5 U3.3
PA4: DAC2(PA4).5 STM32最小系统板.12
PA5: DAC1(PA5).5 STM32最小系统板.11
PA6: ADC1(PA6).5 NOREF#64.1 NOREF#73.1 NOREF#89.1 U2.33
PA7: ADC2.5 STM32最小系统板.14
PA8: U2.41 U4.11
PB0: ADC3(PB0).5 NOREF#19.1 NOREF#30.1 STM32最小系统板.15 U3.4
PB1: STM32最小系统板.18 U4.2
PB2: STM32最小系统板.17 U3.5
PB13: STM32最小系统板.23 U3.6
PB15: STM32最小系统板.49 U3.18
PC6: U2.50 U4.23
PC7: U2.49 U4.15
PC8: U2.40 U4.19
PC9: U2.39 U4.10
PC10: KEY2(PC10).1 NOREF#10.1 NOREF#24.1 NOREF#81.1 U2.45 U4.13
PC11: KEY3(PC11).1 NOREF#27.1 U2.44 U4.21
PC12: KEY4(PC12).1 NOREF#21.1 NOREF#66.1 U2.42 U4.20
PD0: U2.26 四路继电器.1
PD1: U2.25 四路继电器.2
PD2: U2.43 U4.12 四路继电器.3
PD3: U2.24 四路继电器.4
PD4: U2.23 U4.9
PD5: U2.22 U4.18
PD6: U2.48 U4.22
PD7: U2.47 U4.14
PD8: STM32最小系统板.42 U3.21
PD9: STM32最小系统板.41 U3.15
PD10: STM32最小系统板.44 U3.22
PD11: STM32最小系统板.25 U3.7
PD12: STM32最小系统板.28 U4.4
PD13: STM32最小系统板.27 U3.8
PD14: STM32最小系统板.39 U3.14
PD15: STM32最小系统板.37 U3.13
PDC_9959(PG15): AD9959.4 NOREF#44.1 U2.46
PE5: U2.13 U4.8
PE6: U2.14 U4.16
PE7: STM32最小系统板.38 U3.19
PE8: STM32最小系统板.35 U3.12
PE9: STM32最小系统板.36 U4.24
PE10: STM32最小系统板.32 U4.6
PE11: STM32最小系统板.29 U3.9
PE12: STM32最小系统板.31 U3.10
PE13: STM32最小系统板.34 U4.7
PE14: STM32最小系统板.33 U3.11
PE15: STM32最小系统板.40 U3.20
PF2: STM32最小系统板.45 U3.17
PF3: STM32最小系统板.46 U3.23
PF4: STM32最小系统板.43 U3.16
PF5: STM32最小系统板.26 U4.3
PF12: STM32最小系统板.50 U3.24
PF13: STM32最小系统板.30 U4.5
PG10: U2.20 U4.17
RANGE_7606(PB12): AD7606.8 NOREF#32.1 NOREF#43.1 STM32最小系统板.24
RD_7606(PB3): AD7606.2 NOREF#33.1 U2.30
RESET: STM32最小系统板.3
RST_7606(PB6): AD7606.4 NOREF#55.1 U2.32
RST_8688(PC1): AD8688.5 NOREF#16.1 NOREF#65.1 NOREF#90.1 NOREF#93.1 U2.16
RST_9959(PF11): AD9959.6 NOREF#26.1 NOREF#37.1 NOREF#58.1 NOREF#86.1 STM32最小系统板.20
RX1(PA2): STM32最小系统板.8 串口屏.3
RX(PB10): U2.28 串口.1
SCK_5638(PE2): NOREF#7.1 TLV5638.3 U2.12
SCK_9959(PF7): AD9959.12 NOREF#18.1 NOREF#71.1 NOREF#80.1 NOREF#94.1 STM32最小系统板.22
SCL_5351(PF1): SI5351.4 STM32最小系统板.48
SCLK_8688(PC4): AD8688.2 STM32最小系统板.13
SD0_9959(PG11): AD9959.9 U2.10
SD1_9959(PG12): AD9959.11 U2.9
SD2_9959(PG13): AD9959.13 U2.8
SD3_9959(PG14): AD9959.14 NOREF#4.1 NOREF#49.1 U2.7
SDA_5351(PF0): SI5351.3 STM32最小系统板.47
SDC_8688(PC5): AD8688.1 STM32最小系统板.16
SDI_5638(PE3): NOREF#46.1 TLV5638.2 U2.11
SDI_8688(PC0): AD8688.6 NOREF#9.1 NOREF#77.1 U2.15
TX1(PA3): STM32最小系统板.9 串口屏.2
TX(PB11): U2.29 串口.2
UP_9959(PF8): AD9959.8 NOREF#15.1 NOREF#38.1 NOREF#50.1 NOREF#59.1 STM32最小系统板.19
$1N1573: LED1.1 R11.2
$1N9008: KEY4(PC12).2 R16.1
$1N9014: KEY3(PC11).2 R17.1
$1N9020: KEY2(PC10).2 R18.1
$1N9026: KEY1(PA1).2 R19.1

## Routing (per net, layer and track width the routed paths; a pad name or vN(x,y) marks a point on that pad's centre or on a via; arc(x,y) is an arc through that point)
3V3: length 239.2
  Top Layer w0.8: STM32最小系统板.6 STM32最小系统板.4 STM32最小系统板.2 37.38,80.48 U3.1 ; NOREF#8.1 68.99,11.38 63.71,11.38 ; 29.66,11.4 24.85,11.4 21.21,15.04 ; 29.66,11.4 29.66,8.35 31.06,6.95 32.19,6.95 R16.2 ; 29.66,11.4 42.61,11.4 42.63,11.38 43.98,11.38 ; 43.98,11.38 41.8,9.2 R17.2 ; 43.98,11.38 54.07,11.38 ; 63.71,11.38 61.1,8.77 R19.2 ; 63.71,11.38 54.07,11.38 ; 54.07,11.38 51.32,8.64 R18.2 ; NOREF#52.1 2.67,24.06 SI5351.1 ; TLV5638.6 96.86,43.4 99.05,41.21 99.05,26.59 96.4,23.93 86.24,23.93 86.23,23.93 85.6,23.93 NOREF#47.1
  Bottom Layer w0.8: NOREF#78.1 20.95,19.24 NOREF#52.1 9.4,71.55 20.19,82.35 27.05,82.35 28.45,80.95 STM32最小系统板.2 ; NOREF#8.1 75.18,11.48 78.87,15.16 NOREF#47.1
5V: length 8.8
  Bottom Layer w0.8: U4.1 71.53,80.57 U2.1
+5V: length 18.6
  Top Layer w0.8: R11.1 C3.2 79.5,98.08 C1.1 87.67,98.08 电源.1
  Bottom Layer w0.8: 电源.1 88.41,90.66 L3.1
A5V: length 174.8
  Top Layer w0.8: NOREF#69.1 NOREF#31.1 ; NOREF#83.1 82.42,93.78 80.9,95.3 80.38,95.3 80.15,95.08 76.31,95.08 76.09,95.3 70.87,95.3 66.87,99.3 13.58,99.3 11.49,97.21 串口屏.1 ; NOREF.1 NOREF#34.1
  Bottom Layer w0.8: AD7606.7 88.35,7.06 C5.2 88.25,12.36 C4.1 88.65,13.29 NOREF#31.1 ; NOREF#83.1 86.31,88.62 L3.2 NOREF.1 ; NOREF#34.1 92.2,42.98 92.2,42.09 90.81,40.69 NOREF#69.1
DGND: length 129.7
  Top Layer w0.254: SI5351.2 5.61,23.42 NOREF#20.1 14.61,23.55 25.37,23.55 25.44,23.47 28.92,23.47 28.99,23.55 39.5,23.55 43.56,27.61 NOREF#17.1
  Top Layer w0.8: U3.2 39.75,80.31 39.75,84.05 L2.2 27.74,90.78 25.91,88.95 STM32最小系统板.1
  Bottom Layer w0.8: U3.2 43.56,71.93 NOREF#17.1
GND: length 71.7
  Top Layer w0.254: NOREF#13.1 96.52,86.79 AD9959.2
  Top Layer w0.8: NOREF#56.1 67.26,92.71 L2.1
  Bottom Layer w0.254: 电源.2 90.91,92.4 NOREF#13.1
  Bottom Layer w0.8: NOREF#67.1 25.65,9.32 NOREF#61.1 ; NOREF#56.1 80.76,93.78 C1.2
CA_7606(PB7): length 83
  Top Layer w0.254: AD7606.5 83.35,8.01 73.41,17.96 70.49,17.96 69.22,19.23 69.22,27.37 66.75,29.83 66.75,40.11 65.28,41.58 64.01,41.58 63.99,41.59 63.99,42.94 63.33,43.6 61.99,43.6 60.96,44.63 60.96,59.47 61.74,60.25 61.74,60.72 62.68,61.66 63.33,61.66 63.56,61.89 64.86,61.89 68.61,58.13 71.12,58.13 U2.19
CLK_4302(PA12): length 43.4
  Bottom Layer w0.254: U2.34 90.77,39.84 94.23,36.37 94.23,18.77 PE4302.3
CS1_5638(PE0): length 27.9
  Top Layer w0.254: U2.18 74.96,59.36 NOREF#87.1
  Bottom Layer w0.254: NOREF#87.1 85.07,59.36 TLV5638.5
CS2_5638(PE1): length 30.4
  Top Layer w0.254: U2.17 72.3,60.16 73.53,61.39 75.44,61.39 NOREF#39.1
  Bottom Layer w0.254: TLV5638.4 86.8,60.12 NOREF#39.1
CS_7606(PB5): length 75.5
  Top Layer w0.254: NOREF#12.1 NOREF#88.1
  Bottom Layer w0.254: NOREF#88.1 88.52,43.61 73.03,43.61 71.79,42.38 ; NOREF#12.1 91.87,36.19 91.87,3.43 92.13,3.18 92.13,2.12 91.87,1.86 91.87,1.25 91.69,1.07 79.93,1.07 AD7606.3
CS_8688(PC3): length 73.1
  Bottom Layer w0.254: 25.18,72.86 25.18,72.73 23.75,71.3 23.75,9.34 AD8688.3
CS_9959(PF6): length 136.6
  Top Layer w0.254: NOREF#60.1 NOREF#75.1 ; NOREF#57.1 25.87,55.04 STM32最小系统板.21 ; AD9959.10 96.52,74.71 98.63,76.82 98.63,87.34 96.52,89.45 96.52,89.46 95.88,90.09 NOREF#48.1
  Bottom Layer w0.254: NOREF#60.1 18.42,86.79 21.72,90.09 NOREF#48.1 ; NOREF#75.1 NOREF#57.1
D7_7606(PB4): length 91.9
  Bottom Layer w0.254: U2.6 74.06,75.4 72.75,74.09 62.1,74.09 58.29,70.28 58.29,17.7 AD7606.1
DAISY_8688(PC2): length 83.7
  Bottom Layer w0.254: STM32最小系统板.10 28.45,70.54 29.84,71.93 29.84,73.33 29.08,74.09 25.54,74.09 23.39,71.94 23.39,11.49 AD8688.4
DATA_4302(PA11): length 48.5
  Bottom Layer w0.254: PE4302.2 93.73,16.78 93.73,36.12 90.68,39.17 75.69,39.17 75.18,38.66 72.9,38.66 71.54,37.3
LE_4302(PA15): length 52
  Bottom Layer w0.254: 71.54,47.46 72.83,48.76 75.5,48.76 76.07,49.33 87.88,49.33 94.87,42.34 94.87,20.64 PE4302.4
P0_9959(PG6): length 60.6
  Top Layer w0.254: AD9959.1 90.93,80.95 90.93,46.15 79.54,34.76 U2.38
P1_9959(PG7): length 62.3
  Top Layer w0.254: AD9959.3 91.69,79.17 91.69,45.9 79.25,33.45 72.9,33.45 71.59,34.76
P2_9959(PG8): length 69.5
  Top Layer w0.254: AD9959.5 93.98,79.79 95.16,80.97 95.16,85.36 94.74,85.78 93.09,85.78 90.17,82.86 90.17,46.41 81.06,37.3 U2.36
P3_9959(PG9): length 45.7
  Bottom Layer w0.254: 71.95,55.08 73.18,56.31 74.45,56.31 75.44,57.3 75.44,59.88 75.42,59.9 75.42,63.53 78.61,66.73 96.39,66.73 97.79,68.12 97.79,74.22 97.7,74.31 97.7,74.33 96.83,75.2 95.78,75.2 94.6,76.38 AD9959.7
PA1: length 98.2
  Top Layer w0.254: NOREF#41.1 54.23,30.15 49.4,34.98 NOREF#74.1
  Bottom Layer w0.254: STM32最小系统板.5 26.58,75.4 27.69,76.5 27.96,76.5 27.98,76.53 28.92,76.53 28.94,76.5 36.45,76.5 U3.3 40.89,72.06 NOREF#74.1 ; KEY1(PA1).1 60.32,5 54.23,11.1 NOREF#41.1
PA4: length 28.6
  Top Layer w0.254: STM32最小系统板.12 27.27,66.6 21.84,66.6 14.61,73.84 DAC2(PA4).5
PA5: length 33.2
  Top Layer w0.254: STM32最小系统板.11 22.95,67.78 13.76,76.97 13.76,81.41 8.25,86.92 3.56,86.92 DAC1(PA5).5
PA6: length 84.3
  Top Layer w0.254: NOREF#64.1 7.24,60.5 ADC1(PA6).5 ; NOREF#89.1 21.98,38.52 57.67,38.52 60.07,36.12 NOREF#73.1
  Bottom Layer w0.254: U2.33 70.35,39.84 66.63,36.12 NOREF#73.1 ; NOREF#89.1 21.84,38.91 21.84,45.9 NOREF#64.1
PA7: length 36.9
  Top Layer w0.254: STM32最小系统板.14 27.18,63.97 27.18,62.09 26.57,61.49 19.78,61.49 14.99,56.69 14.99,51.39 10.51,46.91 4.53,46.91 4.27,47.17 ADC2.5
PA8: length 30
  Top Layer w0.254: U4.11 68.58,49.45 68.58,31.29 70.23,29.64 71.59,29.64 U2.41
PB0: length 73.5
  Top Layer w0.254: STM32最小系统板.15 25.87,62.66 NOREF#19.1 ; ADC3(PB0).5 NOREF#30.1
  Bottom Layer w0.254: U3.4 31.12,66.6 31.12,64.82 30.23,63.93 27.18,63.93 25.95,62.7 ; NOREF#30.1 17.78,49.07 12.7,54.15 12.7,58.72 NOREF#19.1
PB1: length 48.6
  Top Layer w0.254: STM32最小系统板.18 29.76,60.16 30.99,61.39 30.99,72.95 34.67,76.63 39.12,76.63 40.51,78.03 U4.2
PB2: length 17
  Bottom Layer w0.254: U3.5 30.99,63.93 30.99,61.9 30.48,61.39 27.43,61.39 26.2,60.16 25.95,60.16
PB13: length 21.5
  Bottom Layer w0.254: 26.45,52.54 27.69,53.77 30.48,53.77 31.37,54.66 31.37,61.77 U3.6
PB15: length 23.7
  Bottom Layer w0.254: U3.18 35.79,35.72 35.79,26.54 30.23,20.97 30.23,20.88 30.05,20.7 27.76,20.7 26.58,19.52
PC6: length 13.4
  Bottom Layer w0.254: U4.23 66.8,20.75 72.52,20.75 73.75,19.52 U2.50
PC7: length 29.2
  Top Layer w0.254: U4.15 67.11,40.77 67.11,29.98 69.62,27.47 69.62,21.39 71.49,19.52 U2.49
PC8: length 11.7
  Bottom Layer w0.254: 73.5,32.22 72.26,33.45 68.58,33.45 67.18,34.85 U4.19
PC9: length 29.9
  Top Layer w0.254: U4.10 68.96,51.61 68.96,33.58 70.32,32.22 U2.39
PC10: length 77.1
  Top Layer w0.254: U4.13 67.82,45.14 67.82,30.28 70.36,27.74 70.36,25.45 71.21,24.6 U2.45 ; NOREF#24.1 NOREF#10.1
  Bottom Layer w0.254: U2.45 72.1,24.6 73.41,23.29 74.88,23.29 75.44,22.48 75.44,18.85 74.68,18.09 NOREF#10.1 ; KEY2(PC10).1 NOREF#81.1 48.26,13.51 NOREF#24.1
PC11: length 51.8
  Top Layer w0.254: NOREF#27.1 U4.21
  Bottom Layer w0.254: 74.13,27.14 72.77,28.5 67.69,28.5 66.42,29.77 U4.21 ; NOREF#27.1 55.24,29.77 54.5,29.03 52.22,29.03 47.12,23.93 47.12,10.21 KEY3(PC11).1
PC12: length 62.9
  Top Layer w0.254: KEY4(PC12).1 34.29,4.88 35.81,3.35 37.85,3.35 38.61,4.12 NOREF#21.1 ; NOREF#66.1 U4.20
  Bottom Layer w0.254: U2.42 72.93,30.91 70.36,30.91 68.96,32.31 U4.20 ; NOREF#66.1 57.66,32.06 55.73,30.12 55.09,30.12 54.36,29.39 52.07,29.39 46.76,24.07 46.76,23.7 40.39,17.32 40.39,9.07 39.24,7.93 NOREF#21.1
PD0: length 38
  Bottom Layer w0.254: 四路继电器.1 95.5,31.48 95.5,42.47 87.97,50 U2.26
PD1: length 39.4
  Bottom Layer w0.254: 四路继电器.2 95.88,33.6 95.88,42.72 87.38,51.23 72.9,51.23 71.67,50
PD2: length 58.1
  Top Layer w0.254: 71.59,28.37 71.59,27.17 U2.43 ; 71.59,28.37 70.49,28.37 68.2,30.66 68.2,47.3 U4.12 ; 71.59,28.37 74.93,28.37 81.26,34.7 四路继电器.3
PD3: length 33.4
  Bottom Layer w0.254: U2.24 74.29,52.41 87.59,52.41 98.17,41.83 98.17,38.09 四路继电器.4
PD4: length 12
  Top Layer w0.254: U4.9 70.57,52.54 U2.23
PD5: length 23.7
  Bottom Layer w0.254: U4.18 69.09,43.61 69.09,52.25 70.74,53.9 72.39,53.9 73.57,55.08 U2.22
PD6: length 13.4
  Bottom Layer w0.254: U4.22 65.79,27.23 69.72,23.29 72.9,23.29 73.26,22.94 73.29,22.94 U2.48
PD7: length 29.4
  Top Layer w0.254: U4.14 67.46,42.95 67.46,30.13 69.98,27.61 69.98,23.2 71.12,22.06 U2.47
PD8: length 9.1
  Top Layer w0.254: STM32最小系统板.42 37.38,29.68 U3.21
PD9: length 21.8
  Bottom Layer w0.254: 25.95,29.68 27.18,30.91 30.1,30.91 34.72,35.54 34.72,42.27 U3.15
PD10: length 9.1
  Top Layer w0.254: U3.22 29.81,27.23 29.72,27.14 STM32最小系统板.44
PD11: length 22.5
  Bottom Layer w0.254: U3.7 37.34,65.33 31.75,59.74 31.75,52.12 30.99,51.36 28.08,51.36 26.54,49.82 26.09,49.82 STM32最小系统板.25
PD12: length 57
  Top Layer w0.254: U4.4 41.28,72.95 40,71.68 33.4,71.68 31.88,70.16 31.88,49.62 29.72,47.46 STM32最小系统板.28
PD13: length 22.6
  Bottom Layer w0.254: U3.8 32.13,57.45 32.13,49.33 31.5,48.69 27.18,48.69 25.95,47.46
PD14: length 21.8
  Bottom Layer w0.254: U3.14 34.37,44.45 34.37,37.81 30.01,33.45 27.18,33.45 25.95,32.22
PD15: length 21.7
  Bottom Layer w0.254: U3.13 34.01,46.64 34.01,39.91 30.09,35.99 27.31,35.99 26.07,34.76
PDC_9959(PG15): length 85.5
  Top Layer w0.254: U2.46 74.2,24.56 96.14,24.56 98.43,26.85 98.43,40.94 92.46,46.91 NOREF#44.1
  Bottom Layer w0.254: AD9959.4 98.3,79.68 98.3,67.49 92.46,61.65 NOREF#44.1
PE5: length 9.8
  Bottom Layer w0.254: U4.8 66.55,62.79 68.71,64.95 71.33,64.95 U2.13
PE6: length 29
  Bottom Layer w0.254: 74.29,65.2 73.03,63.93 70.36,63.93 68.33,61.9 68.33,47.93 U4.16
PE7: length 9.1
  Top Layer w0.254: U3.19 37.38,34.76 STM32最小系统板.38
PE8: length 22.6
  Bottom Layer w0.254: 26.33,37.3 27.56,38.53 32.13,38.53 33.66,40.06 33.66,48.82 U3.12
PE9: length 40.7
  Top Layer w0.254: STM32最小系统板.36 33.74,37.3 34.93,36.12 48.9,36.12 U4.24
PE10: length 56.6
  Top Layer w0.254: U4.6 61.59,66.6 34.16,66.6 32.89,65.33 32.89,45.52 29.76,42.38 STM32最小系统板.32
PE11: length 22.7
  Bottom Layer w0.254: U3.9 32.51,55.3 32.51,47.04 31.62,46.15 27.18,46.15 25.95,44.92
PE12: length 22.7
  Bottom Layer w0.254: STM32最小系统板.31 26.83,42.38 28.19,43.74 31.5,43.74 32.77,45.01 32.77,46.79 32.87,46.89 32.87,53.37 37.21,57.71 U3.10
PE13: length 56.1
  Top Layer w0.254: U4.7 39.06,65.33 37.93,64.2 35.07,64.2 33.27,62.41 33.27,43.4 29.72,39.84 STM32最小系统板.34
PE14: length 23
  Bottom Layer w0.254: STM32最小系统板.33 26.45,39.84 27.81,41.2 32.26,41.2 33.27,42.22 33.27,50.98 U3.11
PE15: length 9.1
  Top Layer w0.254: STM32最小系统板.40 28.54,32.31 U3.20
PF2: length 21.8
  Bottom Layer w0.254: U3.17 35.44,37.9 35.44,31.26 30.01,25.83 27.18,25.83 25.95,24.6
PF3: length 9.1
  Top Layer w0.254: STM32最小系统板.46 37.38,24.6 U3.23
PF4: length 21.8
  Bottom Layer w0.254: 25.95,27.14 27.18,28.37 30.1,28.37 35.08,33.35 35.08,40.08 U3.16
PF5: length 57.7
  Top Layer w0.254: STM32最小系统板.26 28.49,49.96 30.73,49.96 31.37,50.6 31.37,72.31 32.77,73.71 36.63,73.71 37,74.08 39.1,74.08 40.13,75.11 62.48,75.11 U4.3
PF12: length 10.1
  Bottom Layer w0.254: STM32最小系统板.50 34.84,19.52 U3.24
PF13: length 57.2
  Top Layer w0.254: STM32最小系统板.30 29.72,44.92 32.38,47.59 32.38,68.38 33.15,69.14 40,69.14 41.28,70.41 U4.5
PG10: length 23.7
  Bottom Layer w0.254: U4.17 68.71,45.77 68.71,54.38 70.64,56.31 72.51,56.31 73.82,57.62 U2.20
RANGE_7606(PB12): length 122.7
  Top Layer w0.254: 28.45,52.5 27.81,52.5 26.54,51.23 24.77,51.23 23.37,49.83 NOREF#43.1 ; NOREF#32.1 22.22,5.77 27.43,0.56 88.07,0.56 90.16,2.65 AD7606.8
  Bottom Layer w0.254: NOREF#43.1 22.25,49.22 22.25,12.65 NOREF#32.1
RD_7606(PB3): length 79
  Top Layer w0.254: NOREF#33.1 75.95,43.14 U2.30
  Bottom Layer w0.254: NOREF#33.1 90.42,38.53 93.37,35.59 93.37,16.63 93.73,16.28 93.73,2.34 91.95,0.56 77.34,0.56 75.85,2.05 AD7606.2
RST_7606(PB6): length 42.5
  Top Layer w0.254: U2.32 75.31,41.23 75.31,38.02 NOREF#55.1
  Bottom Layer w0.254: AD7606.4 80.85,29.44 75.44,34.85 NOREF#55.1
RST_8688(PC1): length 110.2
  Top Layer w0.254: 73.7,62.7 73.7,62.32 72.77,61.39 NOREF#93.1 ; NOREF#90.1 58.55,63.55 NOREF#16.1 ; AD8688.5 12.38,13.2 16.51,17.32 39.88,17.32 NOREF#65.1
  Bottom Layer w0.254: NOREF#93.1 61.47,61.39 NOREF#16.1 ; NOREF#90.1 57.4,34.85 NOREF#65.1
RST_9959(PF11): length 125.2
  Top Layer w0.254: NOREF#86.1 NOREF#37.1 ; NOREF#58.1 96.9,88.06 97.92,87.05 97.92,80.31 AD9959.6 ; NOREF#26.1 24,57.58 25.27,58.85 27.18,58.85 28.41,57.62
  Bottom Layer w0.254: NOREF#86.1 22.86,88.06 NOREF#58.1 ; NOREF#37.1 NOREF#26.1
RX1(PA2): length 33.9
  Top Layer w0.254: STM32最小系统板.8 28.49,72.9 27.29,74.09 18.03,74.09 16.62,75.51 16.62,96.19 串口屏.3
RX(PB10): length 11.4
  Top Layer w0.254: 串口.1 74.36,47.66 U2.28
SCK_5638(PE2): length 31.6
  Top Layer w0.254: NOREF#7.1 76.45,61.01 75.69,61.77 75.69,66.25 U2.12
  Bottom Layer w0.254: NOREF#7.1 76.69,61 86.88,61 95.31,52.57 TLV5638.3
SCK_9959(PF7): length 146.2
  Top Layer w0.254: 28.49,55.08 27.18,53.77 18.8,53.77 NOREF#18.1 ; NOREF#80.1 NOREF#71.1 ; NOREF#94.1 95.25,91.24 98.99,87.5 98.99,74.64 96.52,72.17 AD9959.12
  Bottom Layer w0.254: NOREF#71.1 NOREF#18.1 ; NOREF#94.1 21.34,91.24 NOREF#80.1
SCL_5351(PF1): length 28.5
  Top Layer w0.254: SI5351.4 7.94,20.75 27.14,20.75 STM32最小系统板.48
SCLK_8688(PC4): length 64.8
  Bottom Layer w0.254: AD8688.2 24.13,7.22 24.13,63.3 25.91,65.08 STM32最小系统板.13
SD0_9959(PG11): length 21.2
  Bottom Layer w0.254: AD9959.9 77.72,73.84 74.21,70.32
SD1_9959(PG12): length 24.1
  Bottom Layer w0.254: AD9959.11 93.47,70.79 76.71,70.79 74.93,69.01 72.52,69.01 71.62,69.91 U2.9
SD2_9959(PG13): length 28.6
  Bottom Layer w0.254: U2.8 74.16,72.94 76.33,75.11 94.74,75.11 95.25,74.6 95.25,70.03 AD9959.13
SD3_9959(PG14): length 30.2
  Top Layer w0.254: AD9959.14 NOREF#4.1 ; NOREF#49.1 79.38,66.85 74.68,71.55 72.9,71.55 71.59,72.86
  Bottom Layer w0.254: NOREF#4.1 NOREF#49.1
SDA_5351(PF0): length 24.9
  Top Layer w0.254: STM32最小系统板.47 6.75,22.06 SI5351.3
SDC_8688(PC5): length 63.2
  Bottom Layer w0.254: STM32最小系统板.16 28.09,62.7 26.78,61.39 25.54,61.39 24.78,60.63 24.78,59.5 24.51,59.23 24.51,5.1 AD8688.1
SDI_5638(PE3): length 34.1
  Top Layer w0.254: 71.67,67.78 72.9,69.01 74.68,69.01 76.71,66.98 NOREF#46.1
  Bottom Layer w0.254: NOREF#46.1 77.85,61.52 87.86,61.52 94.44,54.94 96.73,54.94 TLV5638.2
SDI_8688(PC0): length 108.6
  Top Layer w0.254: U2.15 70.19,62.7 68.69,64.2 58.43,64.2 NOREF#9.1 ; AD8688.6 9.88,11.33 16.38,17.83 39.37,17.83 NOREF#77.1
  Bottom Layer w0.254: NOREF#77.1 56.64,35.1 NOREF#9.1
TX1(PA3): length 33.9
  Top Layer w0.254: 串口屏.2 14.12,96.19 14.12,77.12 20.95,70.28 25.87,70.28 STM32最小系统板.9
TX(PB11): length 15.1
  Top Layer w0.254: U2.29 71.59,44.88 71.59,44.75 72.98,46.15 75.44,46.15 76.43,45.16 串口.2
UP_9959(PF8): length 128.8
  Top Layer w0.254: AD9959.8 96.52,77.25 98.27,79 98.27,87.19 96.39,89.08 NOREF#50.1 ; 25.95,57.62 24.77,56.44 20.32,56.44 NOREF#38.1 ; NOREF#15.1 NOREF#59.1
  Bottom Layer w0.254: 19.24,86.09 22.22,89.08 NOREF#50.1 ; NOREF#59.1 NOREF#38.1
$1N1573: length 2
  Top Layer w0.254: R11.2 75.33,96.33 LED1.1
$1N9008: length 3.9
  Top Layer w0.254: R16.1 35.1,7.16 KEY4(PC12).2
$1N9014: length 3.9
  Top Layer w0.254: R17.1 44.5,7.16 KEY3(PC11).2
$1N9020: length 3.9
  Top Layer w0.254: KEY2(PC10).2 54.02,7.16 R18.1
$1N9026: length 3.9
  Top Layer w0.254: KEY1(PA1).2 63.93,7.16 R19.1

## Copper pours and planes (outline as drawn; the poured copper is in the pictures)
3V3 on Top Layer: 24.85,12.59 69.72,12.59 69.72,10.47 24.85,10.47
+5V on Top Layer: 75.93,99.37 89.66,99.37 89.66,95.81 75.93,95.81
DGND on Top Layer: 24.38,91.4 75.62,91.4 75.62,15.3 24.38,15.3
DGND on Top Layer: 0,27.36 75.62,27.36 75.62,15.28 0,15.28
DGND on Bottom Layer: 24.38,91.4 75.62,91.4 75.62,15.26 24.38,15.26
DGND on Bottom Layer: -0.13,27.48 75.62,27.48 75.62,15.3 -0.13,15.3
GND on Top Layer: -1.78,101.91 101.6,101.91 101.6,-1.85 -1.78,-1.85
GND on Bottom Layer: 0,100 100,100 100,0 0,0

## Text on the board
Bottom Silkscreen Layer: PD8 | PE15 | PD10 | PF3 | GND | PA1 | PB0 | PB2 | PB13 | PE11 | PE12 | PF12 | PE7 | 3V3 | PD11 | PD13 | PE14 | PE8 | PD15 | PD14 | PD9 | PF4 | PF2 | PB15 | PC11 | PC12 | PD6 | PC6 | PB1 | PF5 | PD12 | PF13 | PE10 | PD4 | PC9 | PE9 | PC8 | +5V | PE13 | PE5 | PA8 | PD2 | PC10 | PD7 | PC7 | PE6 | PG10 | PD5
Top Silkscreen Layer: RESET | PB13 | PD13 | PE12 | PE14 | PD15 | PD14 | PB15 | PA1 | PC3 | GND | PA3 | PF8 | PA5 | PC4 | PB0 | PB2 | PD11 | PE11 | PF6 | PE8 | PD9 | PF4 | PF2 | PF0 | VREF | PD12 | PF13 | PE10 | PE13 | PE15 | PF12 | PE9 | PD10 | PF3 | PF1 | PB12 | PF11 | PA7 | PC5 | PB1 | PF5 | PE7 | PD8 | 3V3 | PA4 | PF7 | PC2 | PA2 | +5V | VBAT | PG14 | PG12 | PE3 | PE5 | PC0 | PD1 | PA15 | PB11 | PB5 | PA6 | PA11 | PG7 | PC9 | PA8 | PD2 | PC10 | PD7 | PC7 | PE1 | PB7 | PG9 | PD4 | PB4 | PG13 | PG11 | PE2 | PE6 | PC1 | PE0 | PG10 | PD5 | PD3 | PB10 | PB3 | PB6 | PD0 | PA12 | PG8 | PG6 | PC8 | PC12 | PC11 | PG15 | PD6 | PC6 | DATA | (PA7) | SDA | SCL | SDI | RST | DAISY | CS | SCLK | SDC | SD2 SD3 | SD1 SCK | P0 GND | P3  UP | SD0 CS | P2 RST | P1 PDC | CLK | LE | D7 | RD | CA | 5V | RANGE | SCK | CS2 | CS1 | TX | RX | 2025TICUP_PJH_SMY_LZN
